# EAGLE design hot-plate_all_v1.0 (EAGLE 6.2)

## Sheet 1 of 4
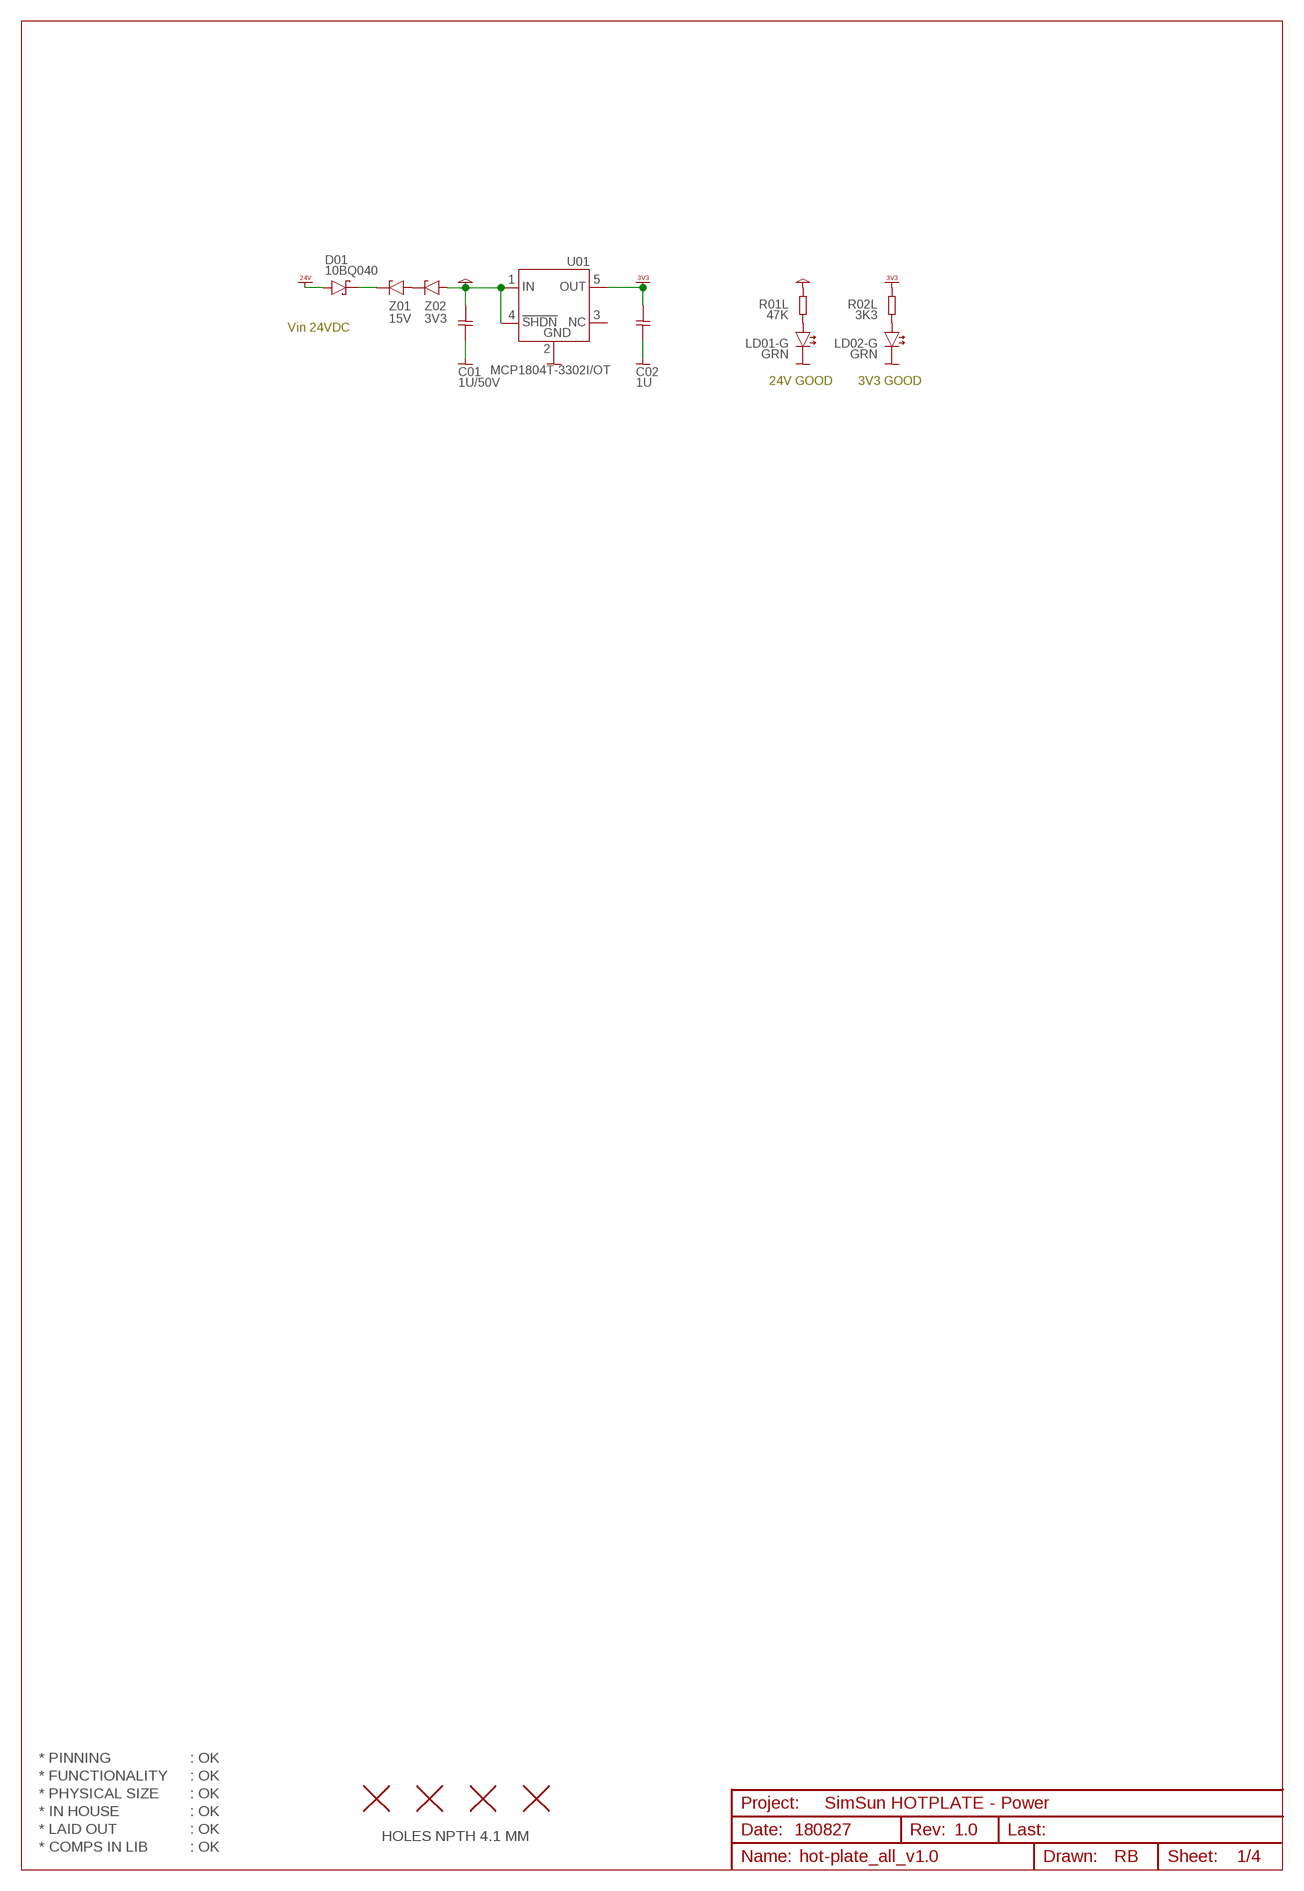
[diagram p0: schematic, sheet 1]

### Parts
C01  1U/50V  CAP0603  [CAP0603]
C02  1U  CAP0603  [CAP0603]
D01  10BQ040  DIODE_15MQ040  [DIODE_SMA]
H1  HOLE_NPTH_4.1MM  [HOLE_NPTH_4.1MM]
H2  HOLE_NPTH_4.1MM  [HOLE_NPTH_4.1MM]
H3  HOLE_NPTH_4.1MM  [HOLE_NPTH_4.1MM]
H4  HOLE_NPTH_4.1MM  [HOLE_NPTH_4.1MM]
LD01-G  GRN  LED_SMD_0603  [LED_SMD_0603]
LD02-G  GRN  LED_SMD_0603  [LED_SMD_0603]
R01L  47K  RES0603  [RES0603]
R02L  3K3  RES0603  [RES0603]
U01  MCP1804T-3302I/OT  [SOT23-5]
Z01  15V  ZENER_SOD80  [ZENER_SOD80]
Z02  3V3  ZENER_SOD80  [ZENER_SOD80]

### Nets
GND: C01.2 C02.2 LD01-G.C LD02-G.C U01.2(2.GND) ; also sheet 2,3,4
N$3: LD02-G.A R02L.2
N$25: LD01-G.A R01L.2
N$151: D01.C(-) Z01.2(-)
N$162: Z01.1(+) Z02.2(-)
VCC: C01.1 R01L.1 U01.1(1.IN) U01.4(4.SHDN) Z02.1(+)
VDD_3V3: C02.1 R02L.1 U01.5(5.OUT) ; supply symbol labelled VCC_3V3 ; also sheet 2,4
VDD_24V: D01.A(+) ; supply symbol labelled VCC_24V ; also sheet 2,3
Unconnected: U01.3(3.NC)

### Notes on the sheet
- Vin 24VDC
- 24V GOOD | 3V3 GOOD
- * PINNING | : OK
- * FUNCTIONALITY | : OK
- * PHYSICAL SIZE | : OK
- SimSun HOTPLATE - Power
- * IN HOUSE | : OK
- * LAID OUT | : OK | 180827 | 1.0
- HOLES NPTH 4.1 MM
- * COMPS IN LIB | : OK

## Sheet 2 of 4
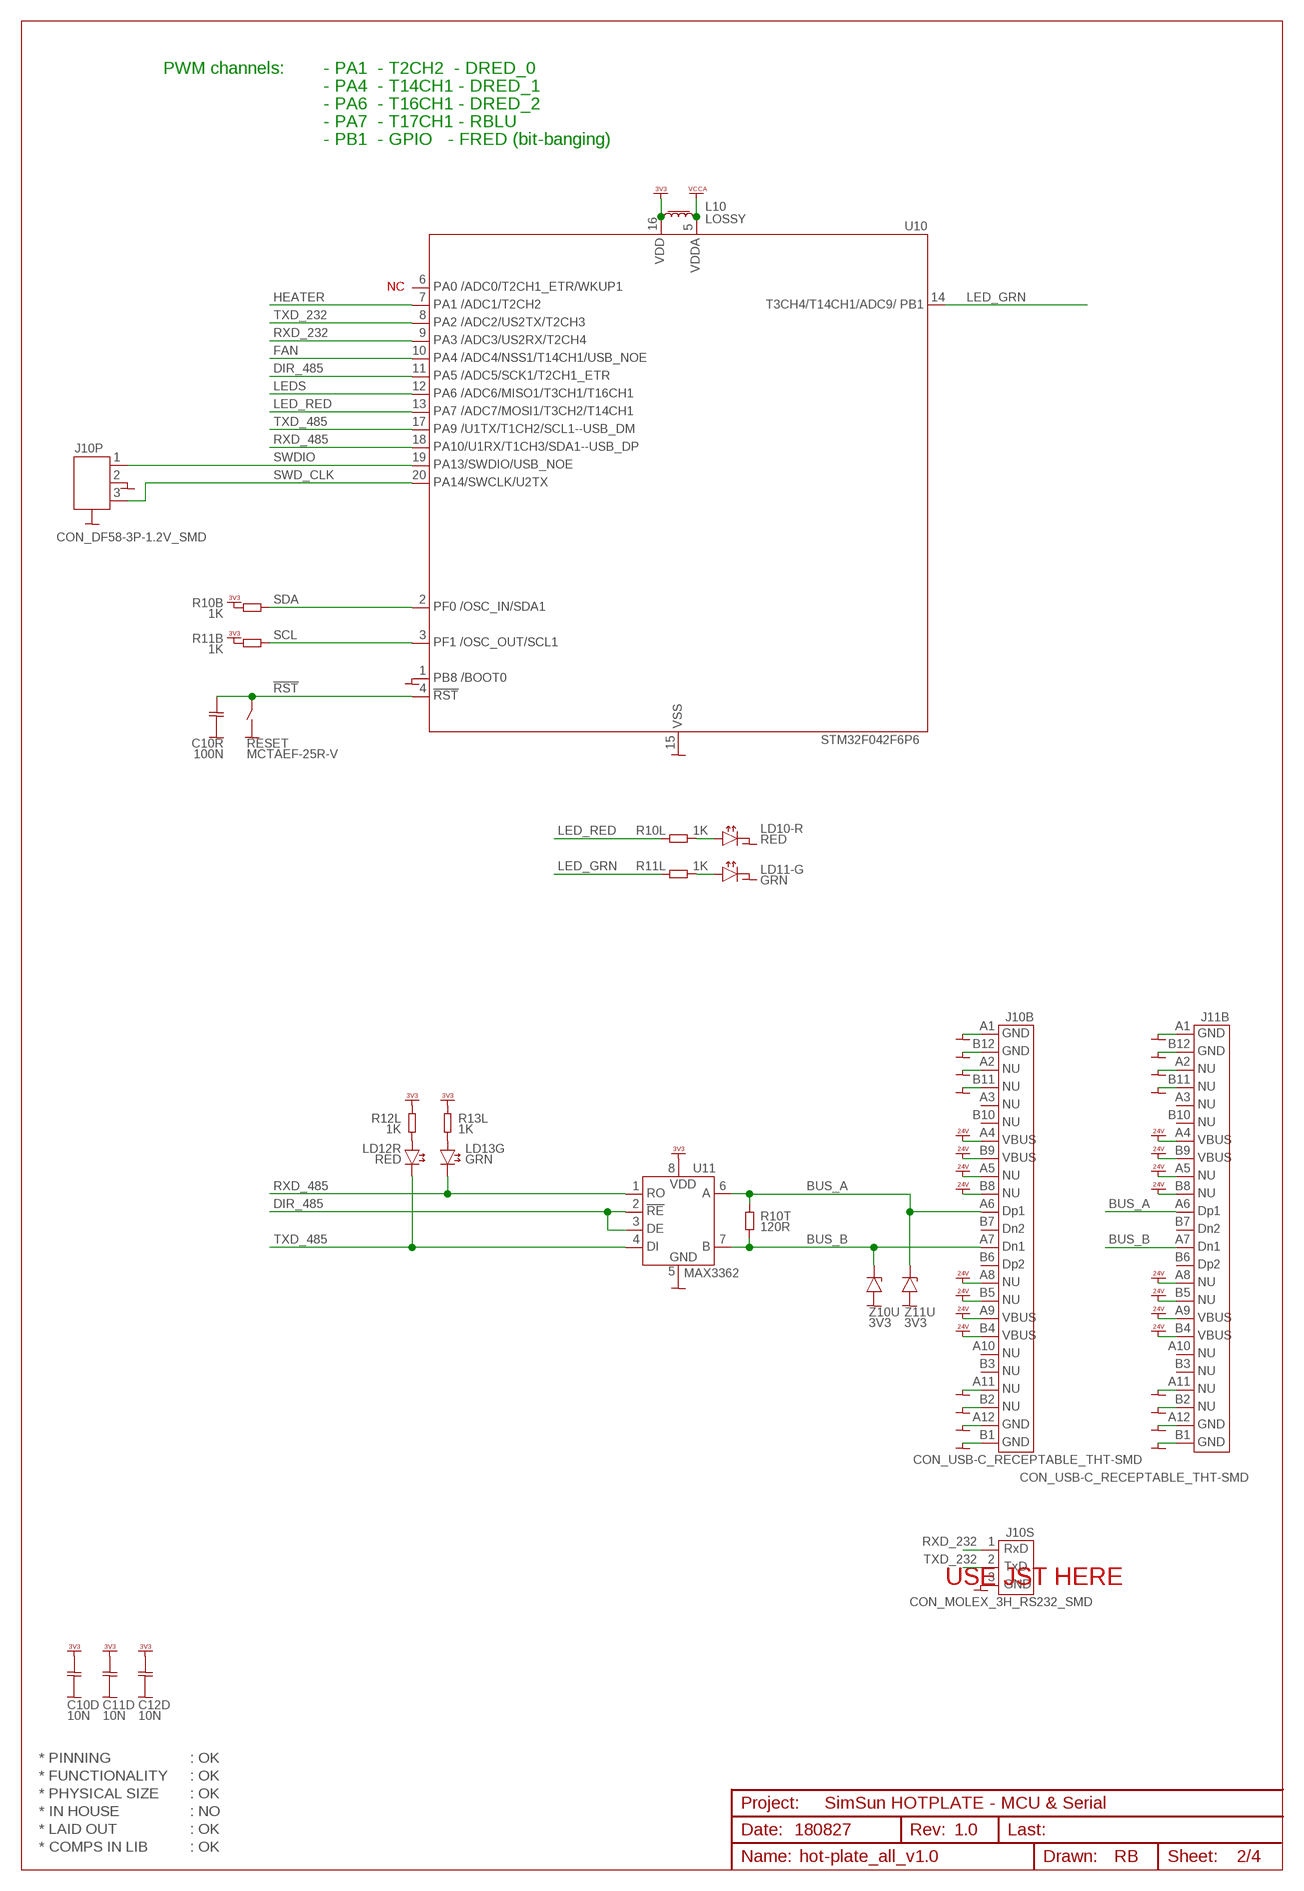
[diagram p1: schematic, sheet 2]

### Parts
C10D  10N  CAP0603  [CAP0603]
C10R  100N  CAP0603  [CAP0603]
C11D  10N  CAP0603  [CAP0603]
C12D  10N  CAP0603  [CAP0603]
J10B  CON_USB-C_RECEPTABLE_THT-SMD  [CON_USB-C_RECEPTABLE_THT-SMD]
J10P  CON_DF58-3P-1.2V_SMD  [CON_DF58-3P-1.2V_SMD]
J10S  CON_MOLEX_3H_RS232_SMD  [CON_MOLEX_3H+SMD]
J11B  CON_USB-C_RECEPTABLE_THT-SMD  [CON_USB-C_RECEPTABLE_THT-SMD]
L10  LOSSY  L_0603  [L_0603]
LD10-R  RED  LED_SMD_0603  [LED_SMD_0603]
LD11-G  GRN  LED_SMD_0603  [LED_SMD_0603]
LD12R  RED  LED_SMD_0603  [LED_SMD_0603]
LD13G  GRN  LED_SMD_0603  [LED_SMD_0603]
R10B  1K  RES0603  [RES0603]
R10L  1K  RES0603  [RES0603]
R10T  120R  RES0603  [RES0603]
R11B  1K  RES0603  [RES0603]
R11L  1K  RES0603  [RES0603]
R12L  1K  RES0603  [RES0603]
R13L  1K  RES0603  [RES0603]
RESET  MCTAEF-25R-V  SWITCH_PUSHBUTTON  [SWITCH_SMD_PBUTTON_2P]
U10  STM32F042F6P6  [TSSOP20]
U11  MAX3362  [SOT23-8]
Z10U  3V3  ZENER_SOD80  [ZENER_SOD80]
Z11U  3V3  ZENER_SOD80  [ZENER_SOD80]

### Nets
!RST: C10R.1 RESET.2(3-4) U10.4(4.!RST)
BUS_A: J10B.A6(A6.DP1) J11B.A6(A6.DP1) R10T.1 U11.6(6.A) Z11U.2(-)
BUS_B: J10B.A7(A7.DN1) J11B.A7(A7.DN1) R10T.2 U11.7(7.B) Z10U.2(-)
DIR_485: U10.11(11.PA5) U11.2(2.!RE) U11.3(3.DE)
FAN: U10.10(10.PA4) ; also sheet 3
GND: C10D.2 C10R.2 C11D.2 C12D.2 J10B.A1(A1.GND) J10B.A2(A2.NU) J10B.A11(A11.NU) J10B.A12(A12.GND) J10B.B1(B1.GND) J10B.B2(B2.NU) J10B.B11(B11.NU) J10B.B12(B12.GND) J10P.2 J10P.GND1 J10P.GND2 J10S.3 J11B.A1(A1.GND) J11B.A2(A2.NU) J11B.A11(A11.NU) J11B.A12(A12.GND) J11B.B1(B1.GND) J11B.B2(B2.NU) J11B.B11(B11.NU) J11B.B12(B12.GND) LD10-R.C LD11-G.C RESET.1(1-2) U10.1(1.BOOT0) U10.15(15.GND) U11.5(5.GND) Z10U.1(+) Z11U.1(+) ; also sheet 1,3,4
HEATER: U10.7(7.PA1) ; also sheet 3
LED_GRN: R11L.1 U10.14(14.PB1)
LED_RED: R10L.1 U10.13(13.PA7)
LEDS: U10.12(12.PA6) ; also sheet 3
N$148: LD11-G.A R11L.2
N$149: LD10-R.A R10L.2
N$152: LD13G.A R13L.2
N$153: LD12R.A R12L.2
RXD_232: J10S.1 U10.9(9.PA3)
RXD_485: LD13G.C U10.18(18.PA10) U11.1(1.RO)
SCL: R11B.2 U10.3(3.OSC_OUT) ; also sheet 4
SDA: R10B.2 U10.2(2.OSC_IN) ; also sheet 4
SWD_CLK: J10P.3 U10.20(20.PA14)
SWDIO: J10P.1 U10.19(19.PA13)
TXD_232: J10S.2 U10.8(8.PA2)
TXD_485: LD12R.C U10.17(17.PA9) U11.4(4.DI)
VCCA: L10.2 U10.5(5.VDDA)
VDD_3V3: C10D.1 C11D.1 C12D.1 L10.1 R10B.1 R11B.1 R12L.1 R13L.1 U10.16(16.VDD) U11.8(8.VDD) ; supply symbol labelled VCC_3V3 ; also sheet 1,4
VDD_24V: J10B.A4(A4.VBUS) J10B.A5(A5.NU) J10B.A8(A8.NU) J10B.A9(A9.VBUS) J10B.B4(B4.VBUS) J10B.B5(B5.NU) J10B.B8(B8.NU) J10B.B9(B9.VBUS) J11B.A4(A4.VBUS) J11B.A5(A5.NU) J11B.A8(A8.NU) J11B.A9(A9.VBUS) J11B.B4(B4.VBUS) J11B.B5(B5.NU) J11B.B8(B8.NU) J11B.B9(B9.VBUS) ; supply symbol labelled VCC_24V ; also sheet 1,3
Unconnected: J10B.A3(A3.NU) J10B.A10(A10.NU) J10B.B3(B3.NU) J10B.B6(B6.DP2) J10B.B7(B7.DN2) J10B.B10(B10.NU) J11B.A3(A3.NU) J11B.A10(A10.NU) J11B.B3(B3.NU) J11B.B6(B6.DP2) J11B.B7(B7.DN2) J11B.B10(B10.NU) U10.6(6.PA0)

### Notes on the sheet
- PWM channels: | - PA1  - T2CH2  - DRED_0
- - PA4  - T14CH1 - DRED_1
- - PA6  - T16CH1 - DRED_2
- - PA7  - T17CH1 - RBLU
- - PB1  - GPIO   - FRED (bit-banging)
- NC
- USE JST HERE
- * PINNING | : OK
- * FUNCTIONALITY | : OK
- * PHYSICAL SIZE | : OK
- SimSun HOTPLATE - MCU & Serial
- * IN HOUSE | : NO
- * LAID OUT | : OK | 180827 | 1.0
- * COMPS IN LIB | : OK

## Sheet 3 of 4
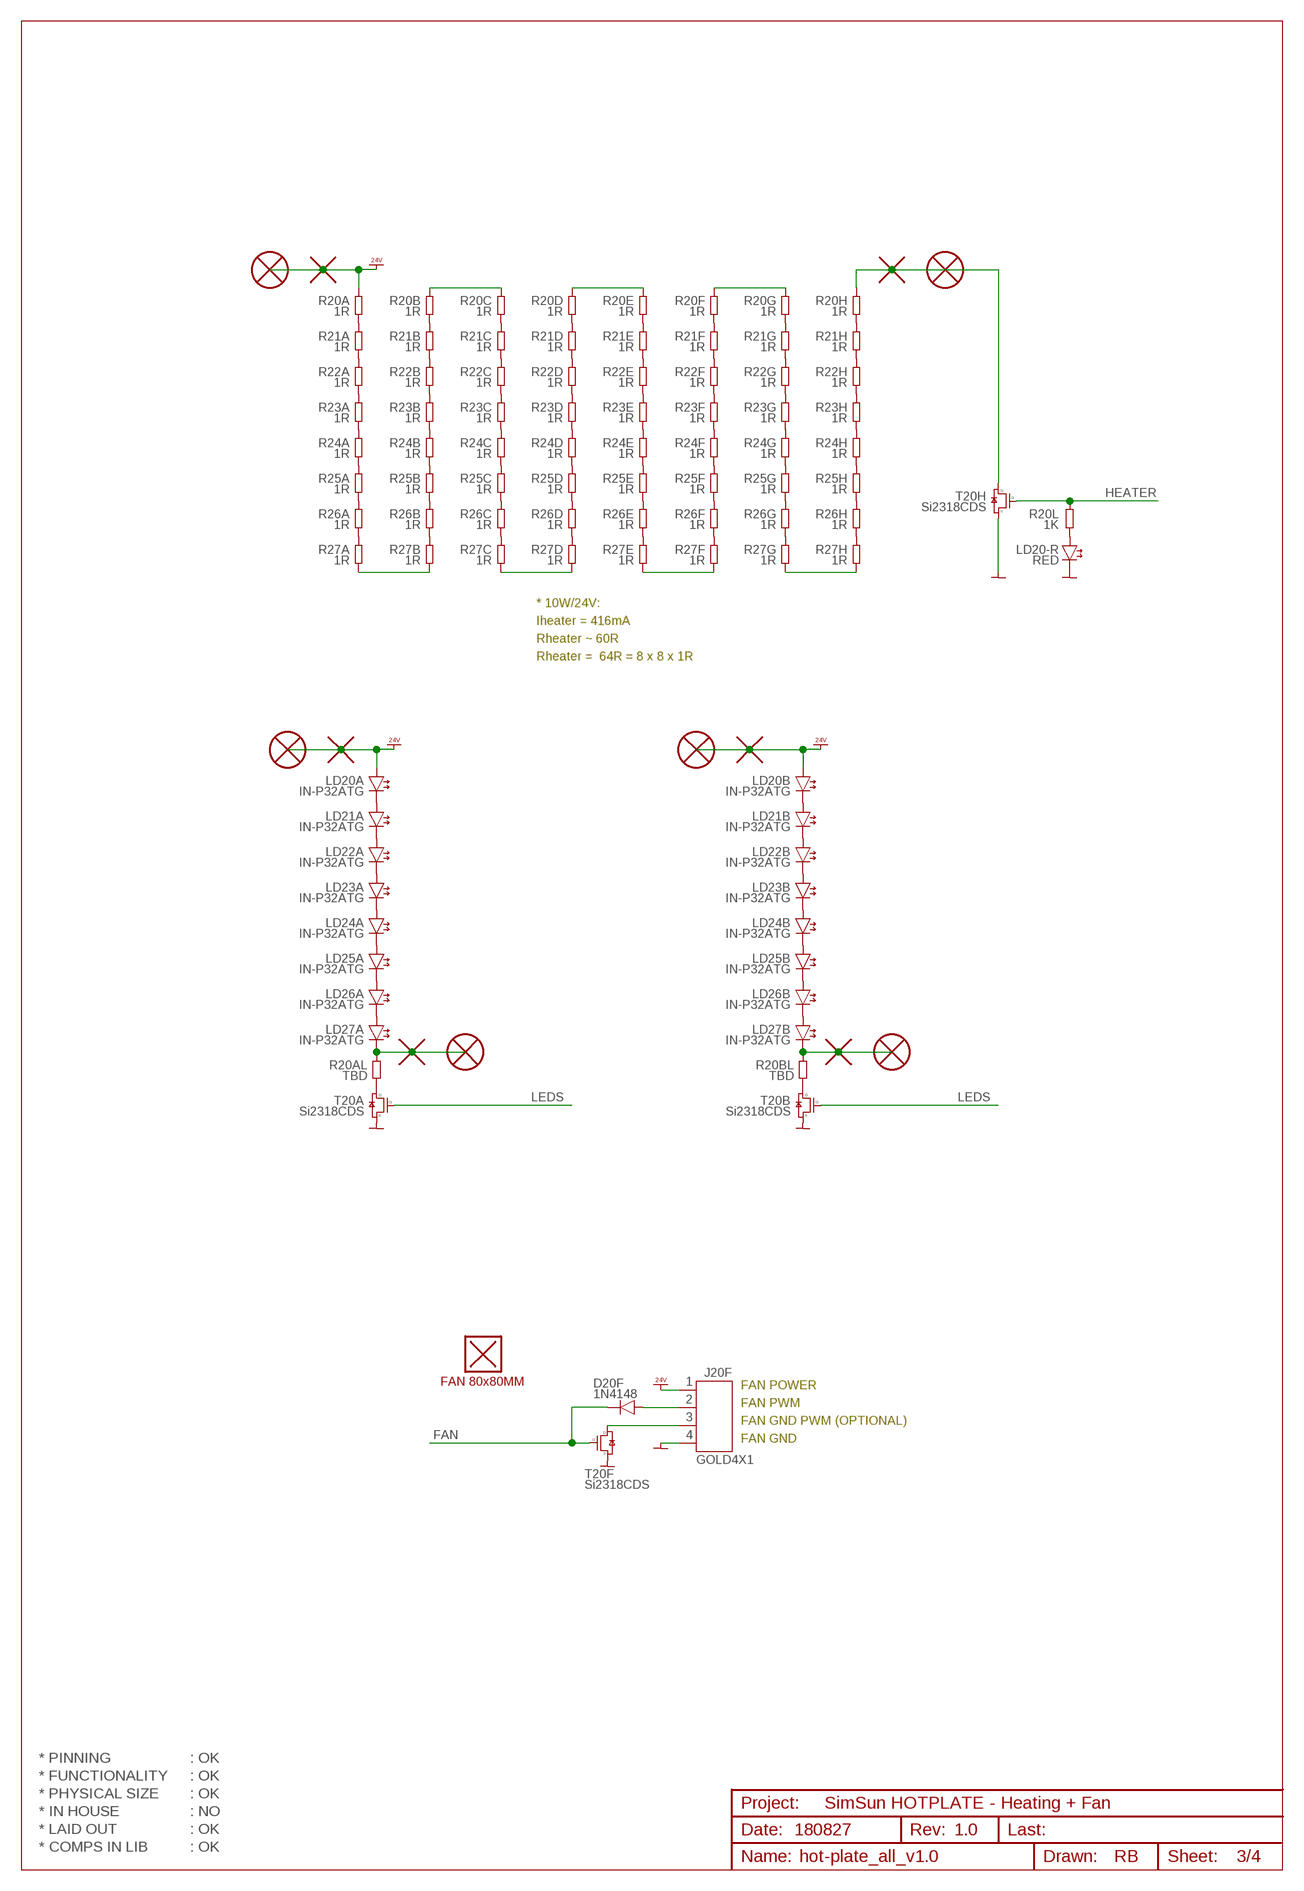
[diagram p2: schematic, sheet 3]

### Parts
D20F  1N4148  DIODE_1N4148WS  [DIODE_SOD323]
H5  HOLE_PTH_1.0MM  [HOLE_PTH_1.0MM]
H6  HOLE_PTH_1.0MM  [HOLE_PTH_1.0MM]
H9  FAN_80X80MM_SANYO_SANACE80  [FAN_80X80MM_SANYO_SANACE80]
H10  HOLE_PTH_1.0MM  [HOLE_PTH_1.0MM]
H15  HOLE_PTH_1.0MM  [HOLE_PTH_1.0MM]
H16  HOLE_PTH_1.0MM  [HOLE_PTH_1.0MM]
H17  HOLE_PTH_1.0MM  [HOLE_PTH_1.0MM]
H18  PAD_ROUND_3.2MM  [PAD_ROUND_3.2MM]
H19  PAD_ROUND_3.2MM  [PAD_ROUND_3.2MM]
H20  PAD_ROUND_3.2MM  [PAD_ROUND_3.2MM]
H21  PAD_ROUND_3.2MM  [PAD_ROUND_3.2MM]
H22  PAD_ROUND_3.2MM  [PAD_ROUND_3.2MM]
H23  PAD_ROUND_3.2MM  [PAD_ROUND_3.2MM]
J20F  GOLD4X1  [GOLD4X1]
LD20-R  RED  LED_SMD_0603  [LED_SMD_0603]
LD20A  IN-P32ATG  LED_SMD_PLCC2  [LED_SMD_PLCC2]
LD20B  IN-P32ATG  LED_SMD_PLCC2  [LED_SMD_PLCC2]
LD21A  IN-P32ATG  LED_SMD_PLCC2  [LED_SMD_PLCC2]
LD21B  IN-P32ATG  LED_SMD_PLCC2  [LED_SMD_PLCC2]
LD22A  IN-P32ATG  LED_SMD_PLCC2  [LED_SMD_PLCC2]
LD22B  IN-P32ATG  LED_SMD_PLCC2  [LED_SMD_PLCC2]
LD23A  IN-P32ATG  LED_SMD_PLCC2  [LED_SMD_PLCC2]
LD23B  IN-P32ATG  LED_SMD_PLCC2  [LED_SMD_PLCC2]
LD24A  IN-P32ATG  LED_SMD_PLCC2  [LED_SMD_PLCC2]
LD24B  IN-P32ATG  LED_SMD_PLCC2  [LED_SMD_PLCC2]
LD25A  IN-P32ATG  LED_SMD_PLCC2  [LED_SMD_PLCC2]
LD25B  IN-P32ATG  LED_SMD_PLCC2  [LED_SMD_PLCC2]
LD26A  IN-P32ATG  LED_SMD_PLCC2  [LED_SMD_PLCC2]
LD26B  IN-P32ATG  LED_SMD_PLCC2  [LED_SMD_PLCC2]
LD27A  IN-P32ATG  LED_SMD_PLCC2  [LED_SMD_PLCC2]
LD27B  IN-P32ATG  LED_SMD_PLCC2  [LED_SMD_PLCC2]
R20A  1R  RES2512  [RES2512]
R20AL  TBD  RES0603  [RES0603]
R20B  1R  RES2512  [RES2512]
R20BL  TBD  RES0603  [RES0603]
R20C  1R  RES2512  [RES2512]
R20D  1R  RES2512  [RES2512]
R20E  1R  RES2512  [RES2512]
R20F  1R  RES2512  [RES2512]
R20G  1R  RES2512  [RES2512]
R20H  1R  RES2512  [RES2512]
R20L  1K  RES0603  [RES0603]
R21A  1R  RES2512  [RES2512]
R21B  1R  RES2512  [RES2512]
R21C  1R  RES2512  [RES2512]
R21D  1R  RES2512  [RES2512]
R21E  1R  RES2512  [RES2512]
R21F  1R  RES2512  [RES2512]
R21G  1R  RES2512  [RES2512]
R21H  1R  RES2512  [RES2512]
R22A  1R  RES2512  [RES2512]
R22B  1R  RES2512  [RES2512]
R22C  1R  RES2512  [RES2512]
R22D  1R  RES2512  [RES2512]
R22E  1R  RES2512  [RES2512]
R22F  1R  RES2512  [RES2512]
R22G  1R  RES2512  [RES2512]
R22H  1R  RES2512  [RES2512]
R23A  1R  RES2512  [RES2512]
R23B  1R  RES2512  [RES2512]
R23C  1R  RES2512  [RES2512]
R23D  1R  RES2512  [RES2512]
R23E  1R  RES2512  [RES2512]
R23F  1R  RES2512  [RES2512]
R23G  1R  RES2512  [RES2512]
R23H  1R  RES2512  [RES2512]
R24A  1R  RES2512  [RES2512]
R24B  1R  RES2512  [RES2512]
R24C  1R  RES2512  [RES2512]
R24D  1R  RES2512  [RES2512]
R24E  1R  RES2512  [RES2512]
R24F  1R  RES2512  [RES2512]
R24G  1R  RES2512  [RES2512]
R24H  1R  RES2512  [RES2512]
R25A  1R  RES2512  [RES2512]
R25B  1R  RES2512  [RES2512]
R25C  1R  RES2512  [RES2512]
R25D  1R  RES2512  [RES2512]
R25E  1R  RES2512  [RES2512]
R25F  1R  RES2512  [RES2512]
R25G  1R  RES2512  [RES2512]
R25H  1R  RES2512  [RES2512]
R26A  1R  RES2512  [RES2512]
R26B  1R  RES2512  [RES2512]
R26C  1R  RES2512  [RES2512]
R26D  1R  RES2512  [RES2512]
R26E  1R  RES2512  [RES2512]
R26F  1R  RES2512  [RES2512]
R26G  1R  RES2512  [RES2512]
R26H  1R  RES2512  [RES2512]
R27A  1R  RES2512  [RES2512]
R27B  1R  RES2512  [RES2512]
R27C  1R  RES2512  [RES2512]
R27D  1R  RES2512  [RES2512]
R27E  1R  RES2512  [RES2512]
R27F  1R  RES2512  [RES2512]
R27G  1R  RES2512  [RES2512]
R27H  1R  RES2512  [RES2512]
T20A  Si2318CDS  NFET_SOT23  [NFET_SOT23]
T20B  Si2318CDS  NFET_SOT23  [NFET_SOT23]
T20F  Si2318CDS  NFET_SOT23  [NFET_SOT23]
T20H  Si2318CDS  NFET_SOT23  [NFET_SOT23]

### Nets
FAN: D20F.1-(-) T20F.1(G1) ; also sheet 2
GND: J20F.4 LD20-R.C T20A.2(S2) T20B.2(S2) T20F.2(S2) T20H.2(S2) ; also sheet 1,2,4
HEATER: R20L.1 T20H.1(G1) ; also sheet 2
LEDS: T20A.1(G1) T20B.1(G1) ; also sheet 2
N$4: R20A.2 R21A.1
N$5: R21A.2 R22A.1
N$6: R22A.2 R23A.1
N$7: R23A.2 R24A.1
N$8: R24A.2 R25A.1
N$9: R25A.2 R26A.1
N$10: R26A.2 R27A.1
N$11: R20B.2 R21B.1
N$12: R21B.2 R22B.1
N$14: R22B.2 R23B.1
N$15: R23B.2 R24B.1
N$16: R24B.2 R25B.1
N$17: R25B.2 R26B.1
N$18: R26B.2 R27B.1
N$19: R27A.2 R27B.2
N$20: R20C.2 R21C.1
N$21: R21C.2 R22C.1
N$22: R22C.2 R23C.1
N$23: R23C.2 R24C.1
N$24: R24C.2 R25C.1
N$26: R25C.2 R26C.1
N$27: R26C.2 R27C.1
N$28: R20B.1 R20C.1
N$29: R20D.2 R21D.1
N$30: R21D.2 R22D.1
N$31: R22D.2 R23D.1
N$32: R23D.2 R24D.1
N$33: R24D.2 R25D.1
N$34: R25D.2 R26D.1
N$35: R26D.2 R27D.1
N$36: R27C.2 R27D.2
N$37: R20E.2 R21E.1
N$38: R21E.2 R22E.1
N$39: R22E.2 R23E.1
N$40: R23E.2 R24E.1
N$41: R24E.2 R25E.1
N$42: R25E.2 R26E.1
N$43: R26E.2 R27E.1
N$44: R20D.1 R20E.1
N$45: R20F.2 R21F.1
N$46: R21F.2 R22F.1
N$47: R22F.2 R23F.1
N$48: R23F.2 R24F.1
N$49: R24F.2 R25F.1
N$50: R25F.2 R26F.1
N$51: R26F.2 R27F.1
N$52: R27E.2 R27F.2
N$53: R20G.2 R21G.1
N$54: R21G.2 R22G.1
N$55: R22G.2 R23G.1
N$56: R23G.2 R24G.1
N$57: R24G.2 R25G.1
N$58: R25G.2 R26G.1
N$59: R26G.2 R27G.1
N$60: R20F.1 R20G.1
N$61: R20H.2 R21H.1
N$62: R21H.2 R22H.1
N$63: R22H.2 R23H.1
N$64: R23H.2 R24H.1
N$65: R24H.2 R25H.1
N$66: R25H.2 R26H.1
N$67: R26H.2 R27H.1
N$68: R27G.2 R27H.2
N$69: H5.1 H19.P R20H.1 T20H.3(D3)
N$70: LD20-R.A R20L.2
N$71: LD20A.C(-) LD21A.A(+)
N$72: LD21A.C(-) LD22A.A(+)
N$73: LD22A.C(-) LD23A.A(+)
N$74: LD23A.C(-) LD24A.A(+)
N$75: LD24A.C(-) LD25A.A(+)
N$76: LD25A.C(-) LD26A.A(+)
N$77: LD20B.C(-) LD21B.A(+)
N$78: LD21B.C(-) LD22B.A(+)
N$79: LD22B.C(-) LD23B.A(+)
N$80: LD23B.C(-) LD24B.A(+)
N$81: LD24B.C(-) LD25B.A(+)
N$82: LD25B.C(-) LD26B.A(+)
N$83: LD26A.C(-) LD27A.A(+)
N$84: LD26B.C(-) LD27B.A(+)
N$85: H16.1 H23.P LD27B.C(-) R20BL.1
N$86: H17.1 H22.P LD27A.C(-) R20AL.1
N$87: R20AL.2 T20A.3(D3)
N$88: R20BL.2 T20B.3(D3)
N$89: J20F.3 T20F.3(D3)
N$90: D20F.2(+) J20F.2
VDD_24V: H6.1 H10.1 H15.1 H18.P H20.P H21.P J20F.1 LD20A.A(+) LD20B.A(+) R20A.1 ; supply symbol labelled VCC_24V ; also sheet 1,2

### Notes on the sheet
- * 10W/24V:
- Iheater = 416mA
- Rheater ~ 60R
- Rheater =  64R = 8 x 8 x 1R
- FAN POWER
- FAN PWM
- FAN GND PWM (OPTIONAL)
- FAN GND
- * PINNING | : OK
- * FUNCTIONALITY | : OK
- * PHYSICAL SIZE | : OK
- SimSun HOTPLATE - Heating + Fan
- * IN HOUSE | : NO
- * LAID OUT | : OK | 180827 | 1.0
- * COMPS IN LIB | : OK

## Sheet 4 of 4
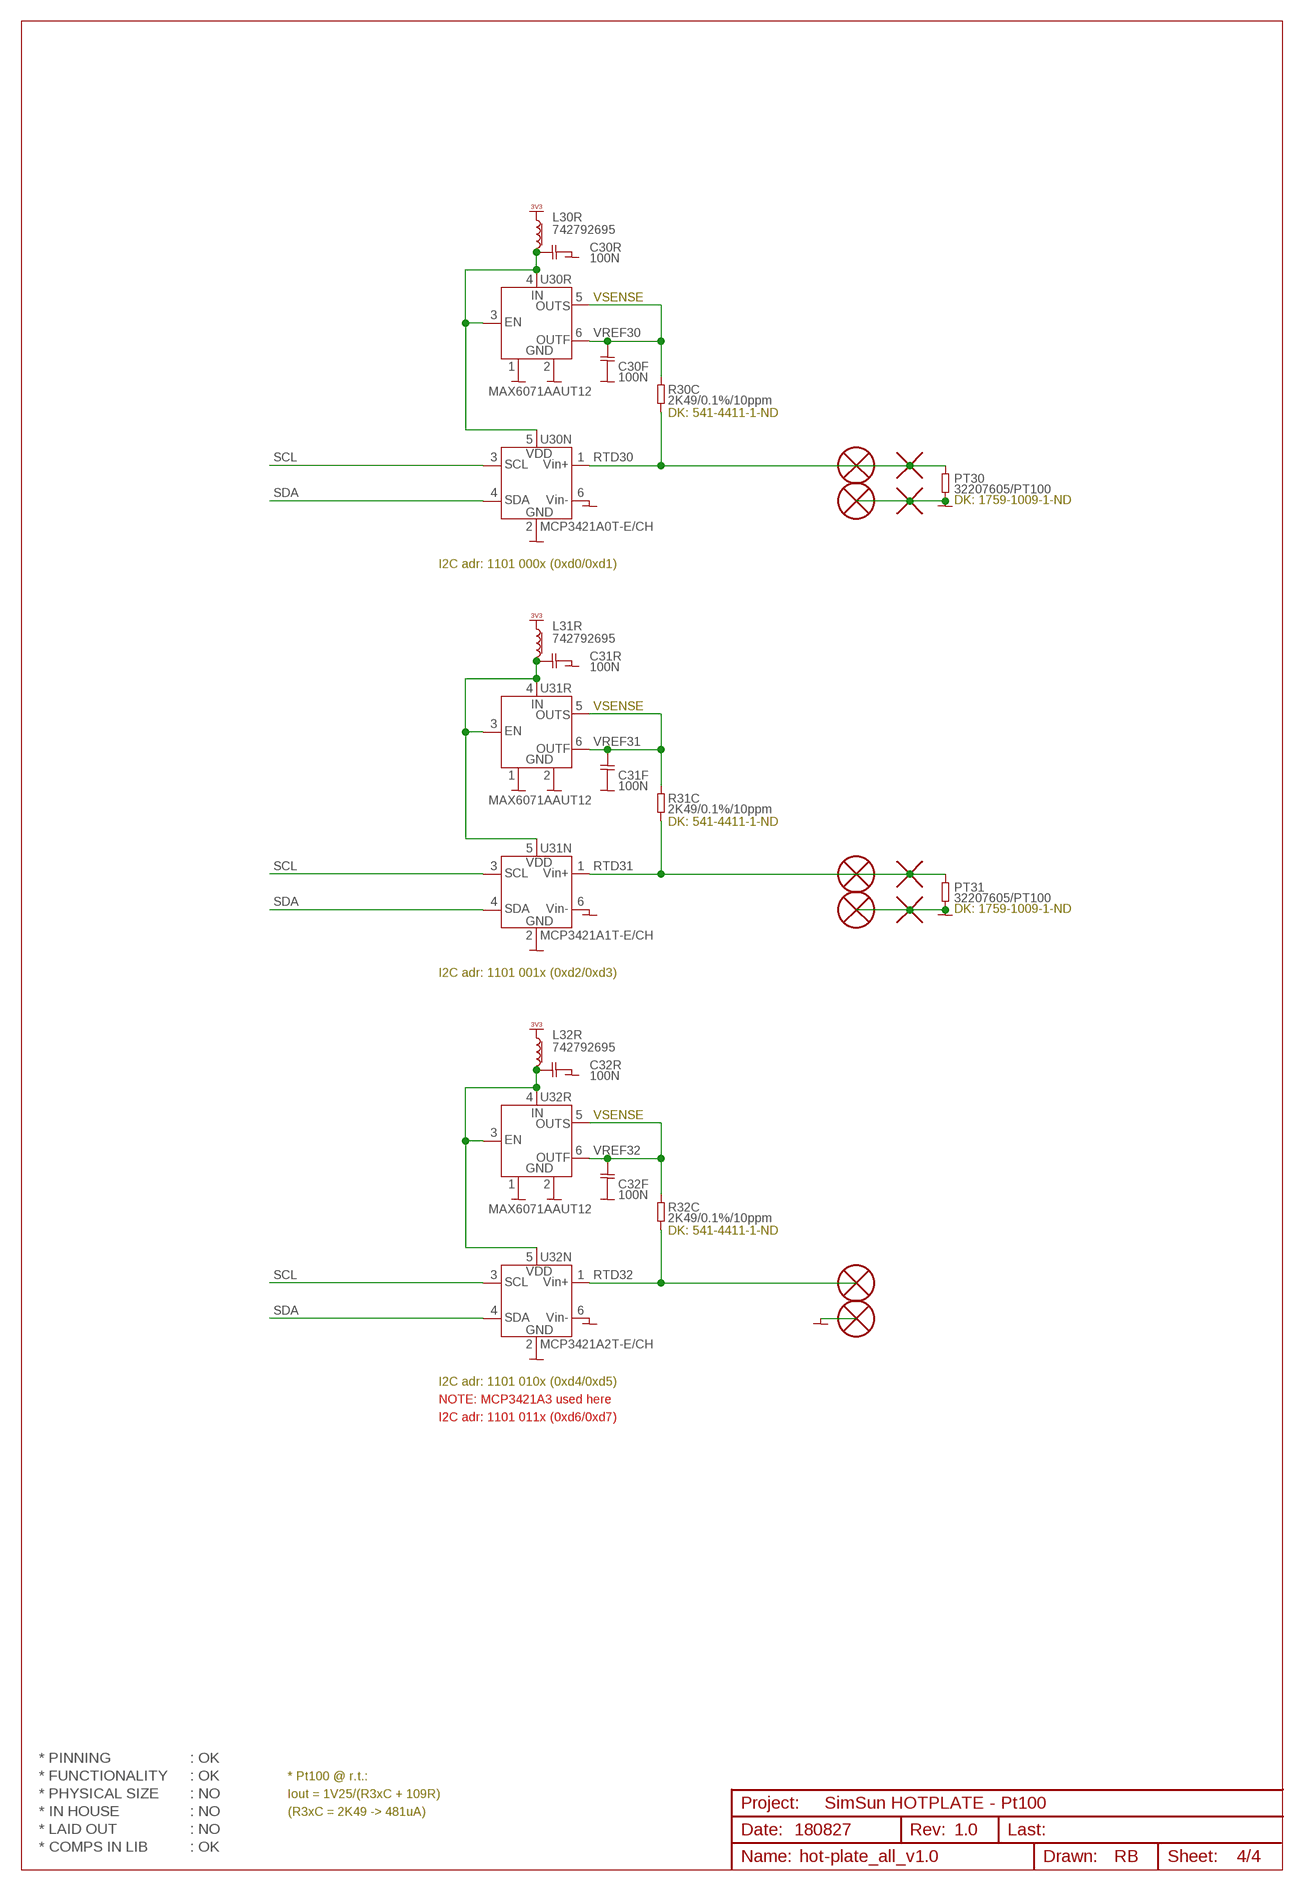
[diagram p3: schematic, sheet 4]

### Parts
C30F  100N  CAP0603  [CAP0603]
C30R  100N  CAP0603  [CAP0603]
C31F  100N  CAP0603  [CAP0603]
C31R  100N  CAP0603  [CAP0603]
C32F  100N  CAP0603  [CAP0603]
C32R  100N  CAP0603  [CAP0603]
H7  HOLE_PTH_1.0MM  [HOLE_PTH_1.0MM]
H8  HOLE_PTH_1.0MM  [HOLE_PTH_1.0MM]
H11  HOLE_PTH_1.0MM  [HOLE_PTH_1.0MM]
H12  HOLE_PTH_1.0MM  [HOLE_PTH_1.0MM]
H13  HOLE_PTH_1.0MM  [HOLE_PTH_1.0MM]
H14  HOLE_PTH_1.0MM  [HOLE_PTH_1.0MM]
H24  PAD_ROUND_3.2MM  [PAD_ROUND_3.2MM]
H25  PAD_ROUND_3.2MM  [PAD_ROUND_3.2MM]
H26  PAD_ROUND_3.2MM  [PAD_ROUND_3.2MM]
H27  PAD_ROUND_3.2MM  [PAD_ROUND_3.2MM]
L30R  742792695  L_0603  [L_0603]
L31R  742792695  L_0603  [L_0603]
L32R  742792695  L_0603  [L_0603]
PT30  32207605/PT100  RES0805  [RES0805]
PT31  32207605/PT100  RES0805  [RES0805]
R30C  2K49/0.1%/10ppm  RES0603  [RES0603]
R31C  2K49/0.1%/10ppm  RES0603  [RES0603]
R32C  2K49/0.1%/10ppm  RES0603  [RES0603]
U30N  MCP3421A0T-E/CH  [SOT23-6]
U30R  MAX6071AAUT12  [SOT23-6]
U31N  MCP3421A1T-E/CH  [SOT23-6]
U31R  MAX6071AAUT12  [SOT23-6]
U32N  MCP3421A2T-E/CH  [SOT23-6]
U32R  MAX6071AAUT12  [SOT23-6]

### Nets
GND: C30F.1 C30R.1 C31F.1 C31R.1 C32F.1 C32R.1 H8.1 H12.1 H14.1 H25.P H27.P PT30.2 PT31.2 U30N.2(2.VSS) U30N.6(6.VIN-) U30R.1(1.GND) U30R.2(2.GND) U31N.2(2.VSS) U31N.6(6.VIN-) U31R.1(1.GND) U31R.2(2.GND) U32N.2(2.VSS) U32N.6(6.VIN-) U32R.1(1.GND) U32R.2(2.GND) ; also sheet 1,2,3
N$1: C31R.2 L31R.2 U31N.5(5.VDD) U31R.3(3.EN) U31R.4(4.IN)
N$2: C32R.2 L32R.2 U32N.5(5.VDD) U32R.3(3.EN) U32R.4(4.IN)
N$13: C30R.2 L30R.2 U30N.5(5.VDD) U30R.3(3.EN) U30R.4(4.IN)
RTD30: H7.1 H24.P PT30.1 R30C.2 U30N.1(1.VIN+)
RTD31: H11.1 H26.P PT31.1 R31C.2 U31N.1(1.VIN+)
RTD32: H13.1 R32C.2 U32N.1(1.VIN+)
SCL: U30N.3(3.SCL) U31N.3(3.SCL) U32N.3(3.SCL) ; also sheet 2
SDA: U30N.4(4.SDA) U31N.4(4.SDA) U32N.4(4.SDA) ; also sheet 2
VDD_3V3: L30R.1 L31R.1 L32R.1 ; supply symbol labelled VCC_3V3 ; also sheet 1,2
VREF30: C30F.2 R30C.1 U30R.5(5.OUTS) U30R.6(6.OUTF)
VREF31: C31F.2 R31C.1 U31R.5(5.OUTS) U31R.6(6.OUTF)
VREF32: C32F.2 R32C.1 U32R.5(5.OUTS) U32R.6(6.OUTF)

### Notes on the sheet
- VSENSE
- DK: 541-4411-1-ND
- DK: 1759-1009-1-ND
- I2C adr: 1101 000x (0xd0/0xd1)
- VSENSE
- DK: 541-4411-1-ND
- DK: 1759-1009-1-ND
- I2C adr: 1101 001x (0xd2/0xd3)
- VSENSE
- DK: 541-4411-1-ND
- I2C adr: 1101 010x (0xd4/0xd5)
- NOTE: MCP3421A3 used here
- I2C adr: 1101 011x (0xd6/0xd7)
- * PINNING | : OK
- * FUNCTIONALITY | : OK | * Pt100 @ r.t.:
- * PHYSICAL SIZE | : NO | Iout = 1V25/(R3xC + 109R)
- SimSun HOTPLATE - Pt100
- * IN HOUSE | : NO | (R3xC = 2K49 -> 481uA)
- * LAID OUT | : NO | 180827 | 1.0
- * COMPS IN LIB | : OK

## Library data of the parts
C01 C02 C10D C10R C11D C12D C30F C30R C31F C31R C32F C32R = 00-own_parts:CAP0603: Capacitor, ceramic, 0603
D01 = 00-own_parts:DIODE_15MQ040: Diode, Schottky, 15MQ040, 40V/3A, SMA, F# 165-1114
D20F = 00-own_parts:DIODE_1N4148WS: Diode, 1N4148WS, high speed, 100V/350mA, SOD323
H1-H4 = 00-own_parts:HOLE_NPTH_4.1MM: Hole, NPTH, 4.1mm
H5-H8 H10-H17 = 00-own_parts:HOLE_PTH_1.0MM: Hole, PTH, 1.0mm
H9 = 00-own_parts:FAN_80X80MM_SANYO_SANACE80: Fan, 80x80MM, Sanyo 9GA0824P7G001, with PWM control function & pulse sensor, DK# 1688-1603-ND
H18-H27 = 00-own_parts:PAD_ROUND_3.2MM: Pad, SMD, round 3.2mm
J10B J11B = 00-own_parts:CON_USB-C_RECEPTABLE_THT-SMD: Connector, DB25, male, straight, wirewarp, press nuts, DK#: 2625FA-ND
J10P = 00-own_parts:CON_DF58-3P-1.2V_SMD: Connector, DF58, 3 way, 1,2mm pitch, SMD
J10S = 00-own_parts:CON_MOLEX_3H_RS232_SMD: Connector, RS232, 3p, SMD pads
J20F = 00-own_parts:GOLD4X1: Header, gold fingers, 0.1", 4x1
L10 L30R L31R L32R = 00-own_parts:L_0603: Inductor, 0603, chip ferrite bead
LD01-G LD02-G LD10-R LD11-G LD12R LD13G LD20-R = 00-own_parts:LED_SMD_0603: LED, SMD, 0603
LD20A LD20B LD21A LD21B LD22A LD22B LD23A LD23B LD24A LD24B LD25A LD25B LD26A LD26B LD27A LD27B = 00-own_parts:LED_SMD_PLCC2: LED, SMD, PLCC2
PT30 PT31 R01L R02L R10B R10L R10T R11B R11L R12L R13L R20A R20AL R20B R20BL R20C R20D R20E R20F R20G R20H R20L R21A R21B R21C R21D R21E R21F R21G R21H R22A R22B R22C R22D R22E R22F R22G R22H R23A R23B R23C R23D R23E R23F R23G R23H R24A R24B R24C R24D R24E R24F R24G R24H R25A R25B R25C R25D R25E R25F R25G R25H R26A R26B R26C R26D R26E R26F R26G R26H R27A R27B R27C R27D R27E R27F R27G R27H R30C R31C R32C = 00-own_parts:RES
RESET = 00-own_parts:SWITCH_PUSHBUTTON: Switch, push button, SPNO, MCTAEF, F# 160-5485
T20A T20B T20F T20H = 00-own_parts:NFET_SOT23: n-FET, generic SOT23
U01 = 00-own_parts:MCP1804T-3302I/OT: Regulator, LDO w. enable, Vin=2.0..28V, Vout=3V3, Vdrop = 260mV, SOT23-5,
U10 = 00-own_parts:STM32F042F6P6: MCU, low power, ARM Cortex M0, 32-bit, 48 MHz, 32 kB Flash, 6 kB SRAM, 8 kB EEPROM, RTC, xtal-less USB, ADC, cap. touch sensing, TSSOP20
U11 = 00-own_parts:MAX3362: Transceiver, RS485/422, 3V3, SOT23-8
U30N = 00-own_parts:MCP3421A0T-E/CH: ADC, 18-bit sigma-delta, diff. input, w. PGA, internal reference, I2C address 0, SOT23-6, F#160-5567
U30R U31R U32R = 00-own_parts:MAX6071AAUT12: Reference, with enable, 1V25, low noise, 0.04% tol., 6ppm.oC, 10mA SOT23-6
U31N = 00-own_parts:MCP3421A1T-E/CH: ADC, 18-bit sigma-delta, diff. input, w. PGA, internal reference, I2C address 1, SOT23-6
U32N = 00-own_parts:MCP3421A2T-E/CH: ADC, 18-bit sigma-delta, diff. input, w. PGA, internal reference, I2C address 2, SOT23-6
Z01 Z02 Z10U Z11U = 00-own_parts:ZENER_SOD80: Zener, generic SOD80

## Board
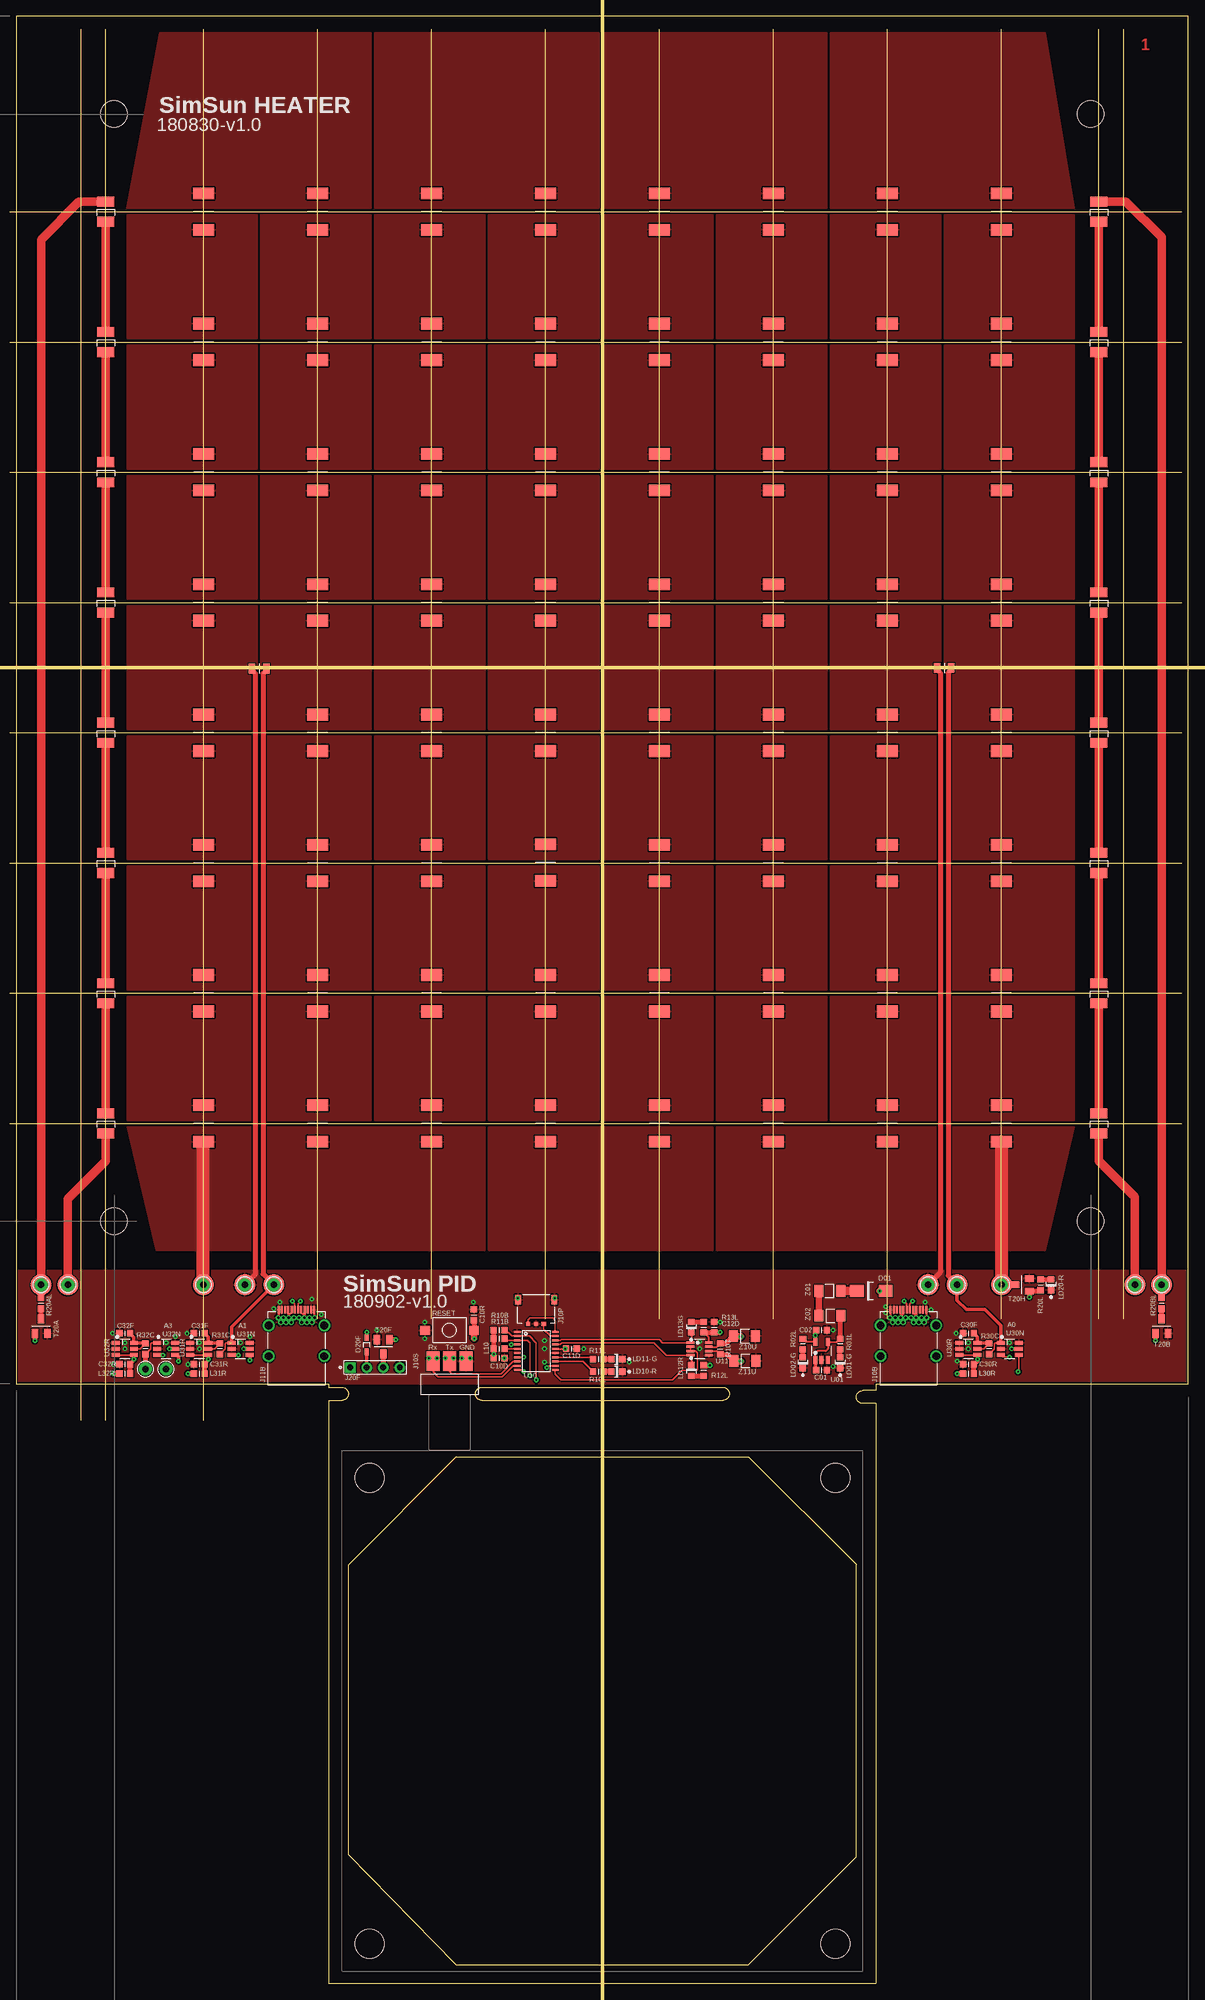
[diagram p4: board, top side]
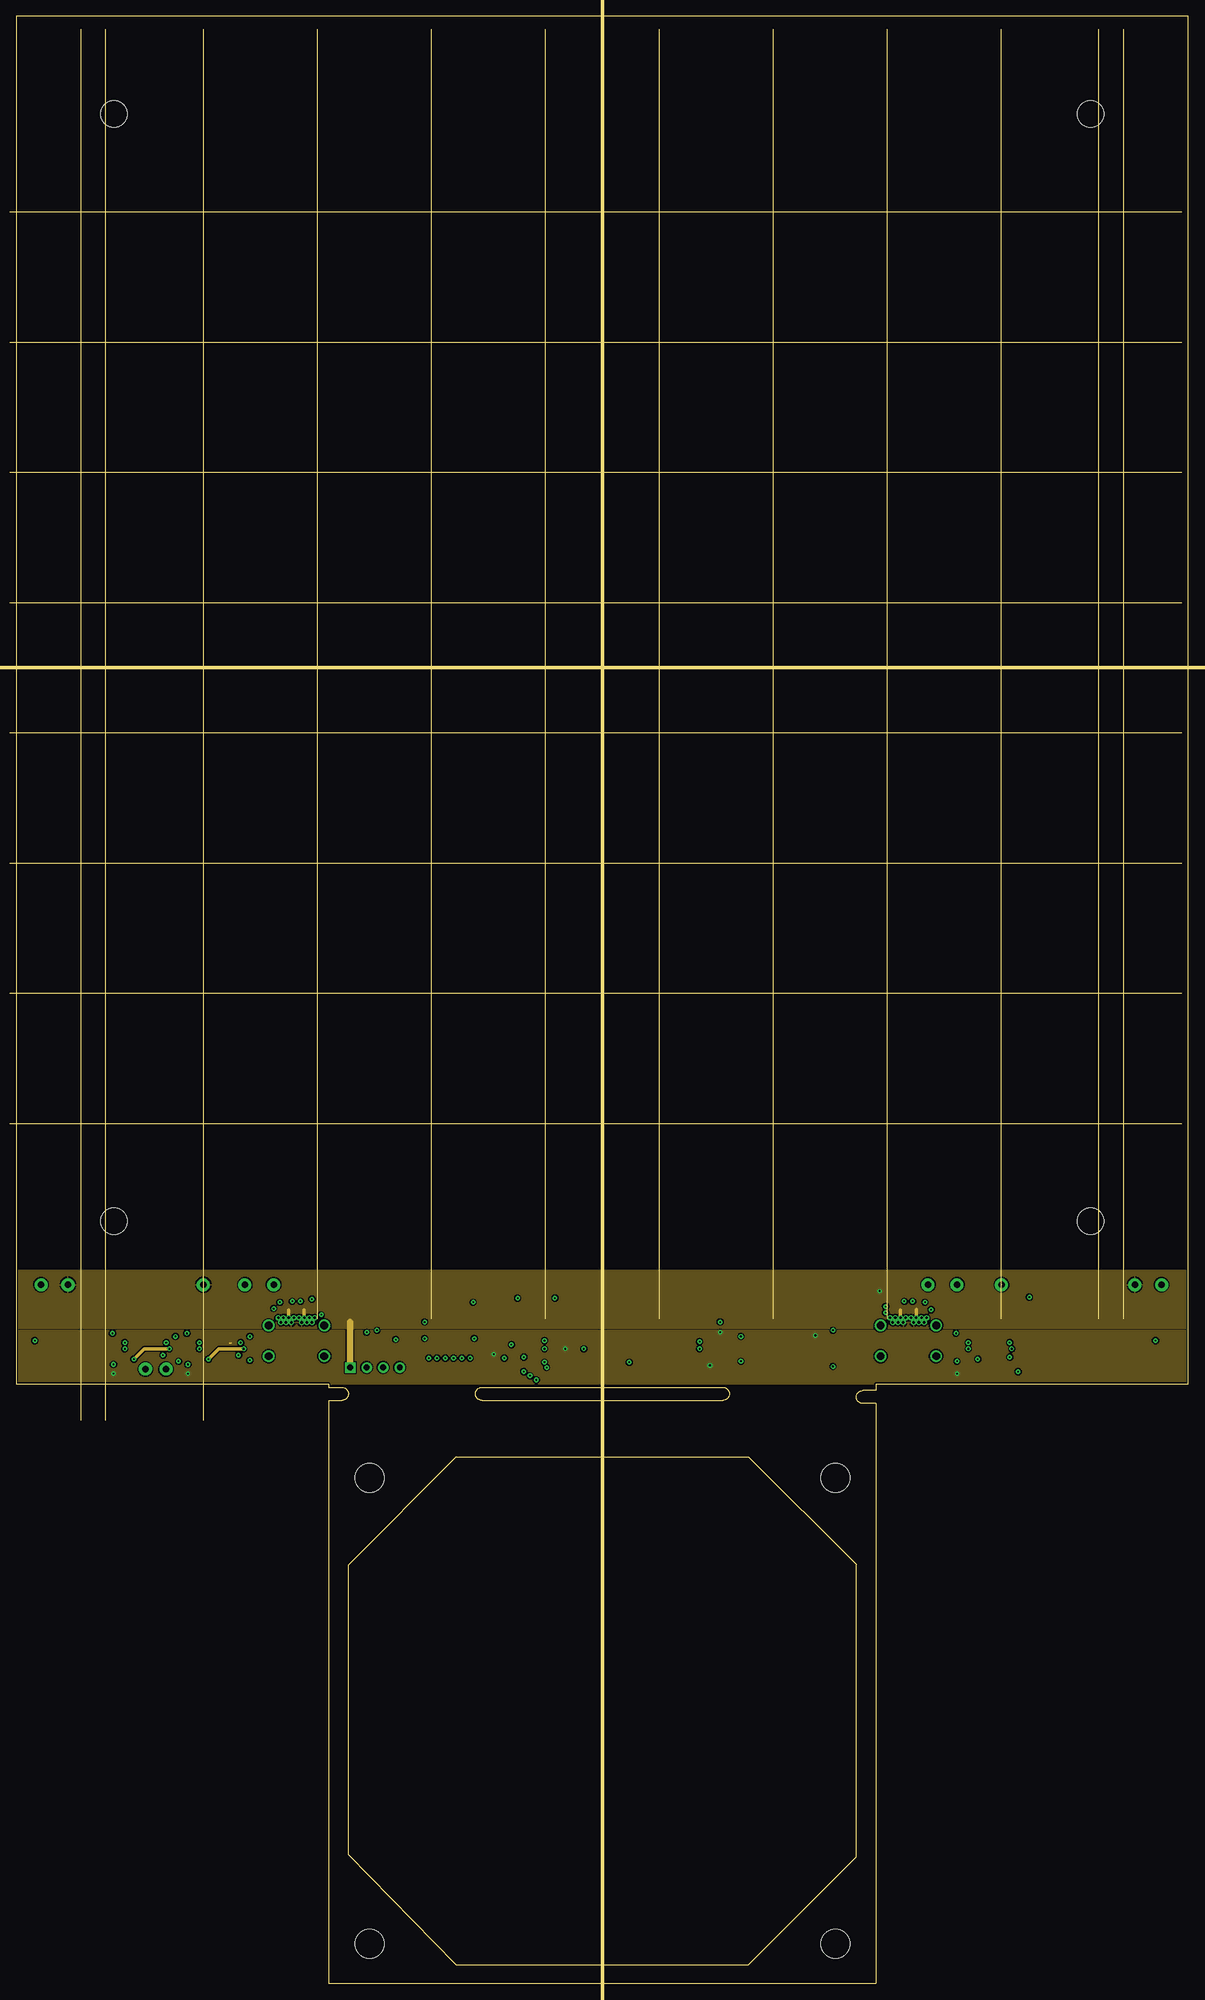
[diagram p5: board, inner layer Route2]
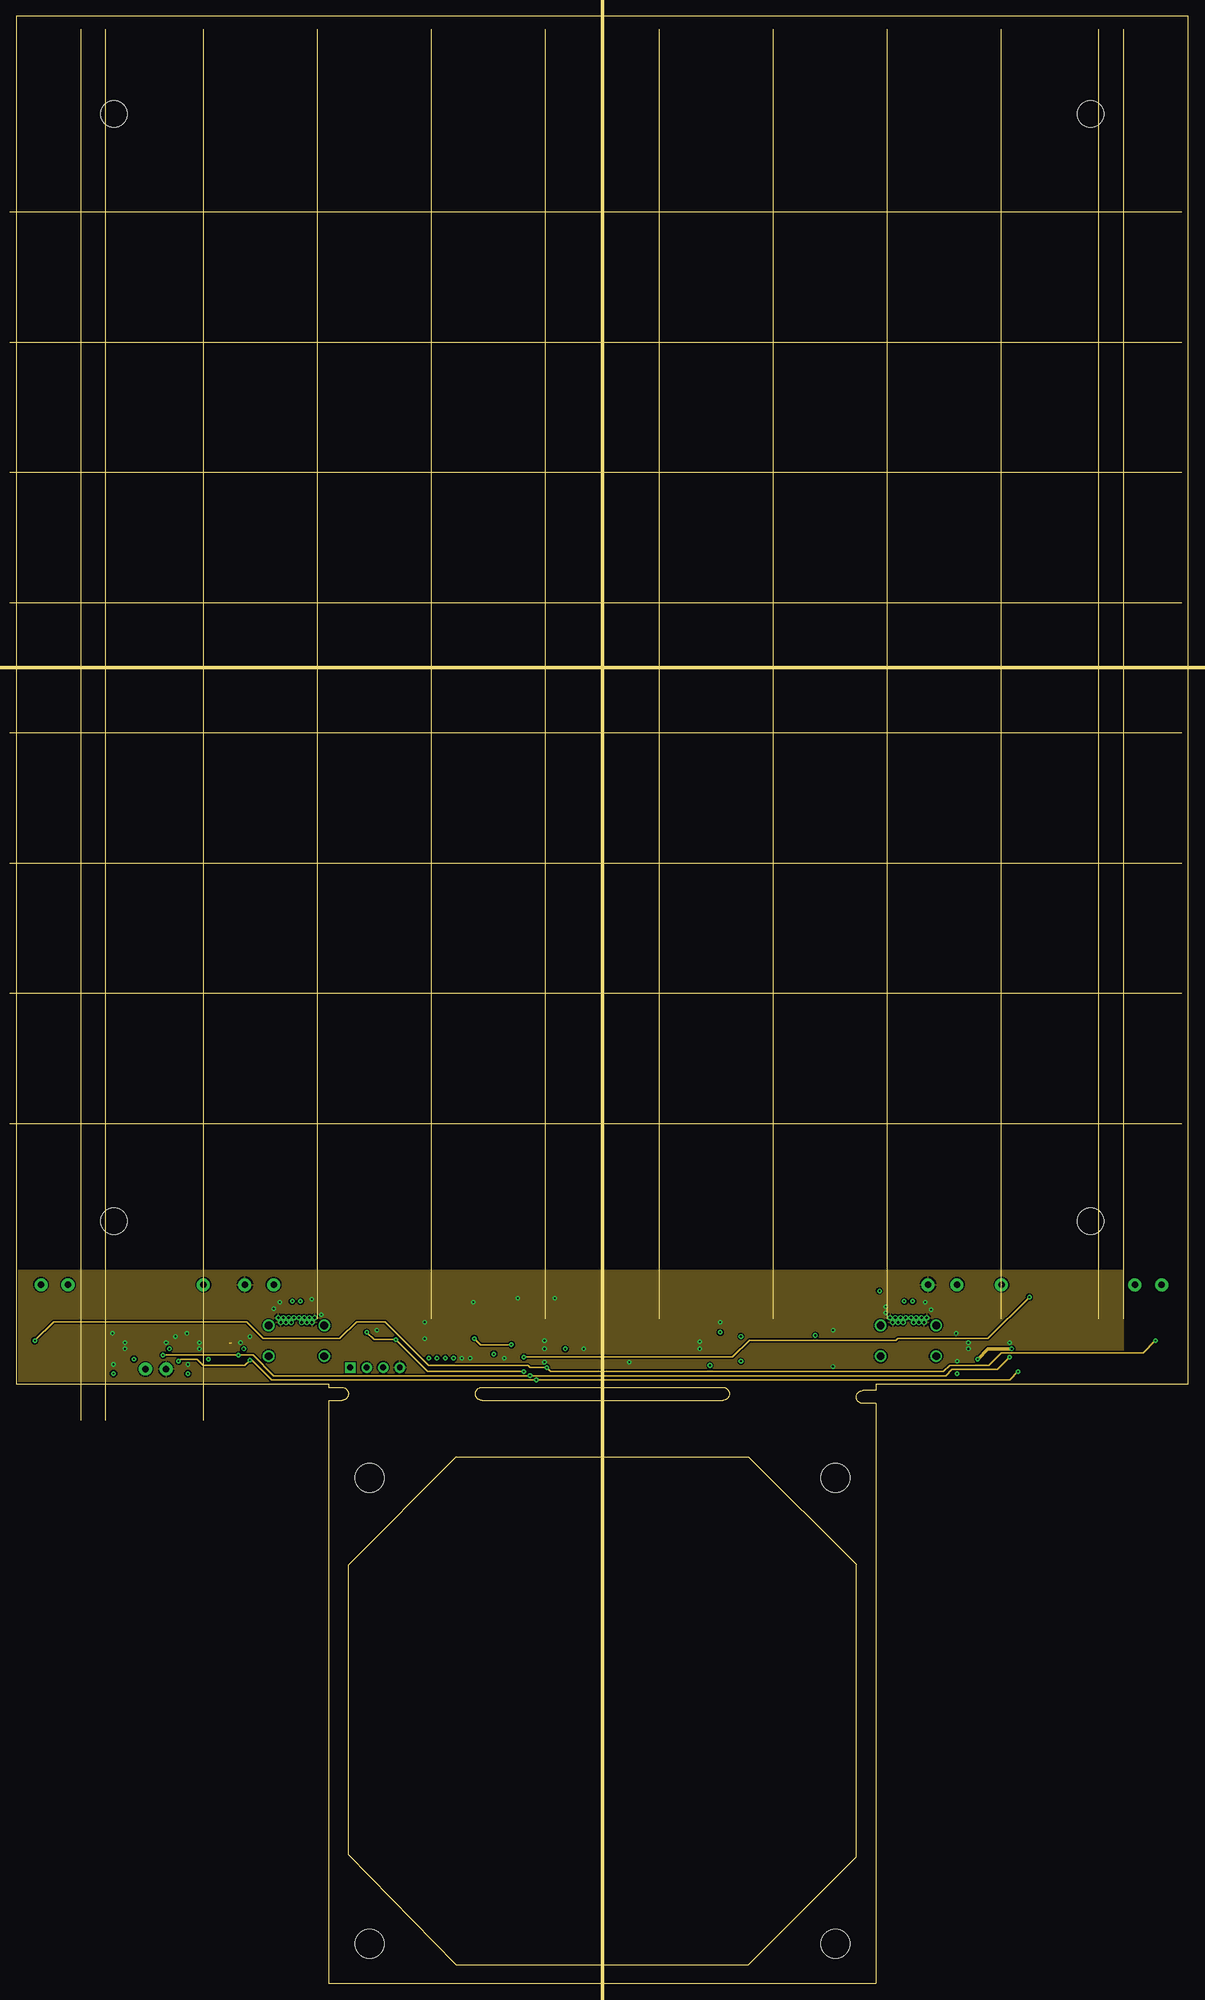
[diagram p6: board, inner layer Route15]
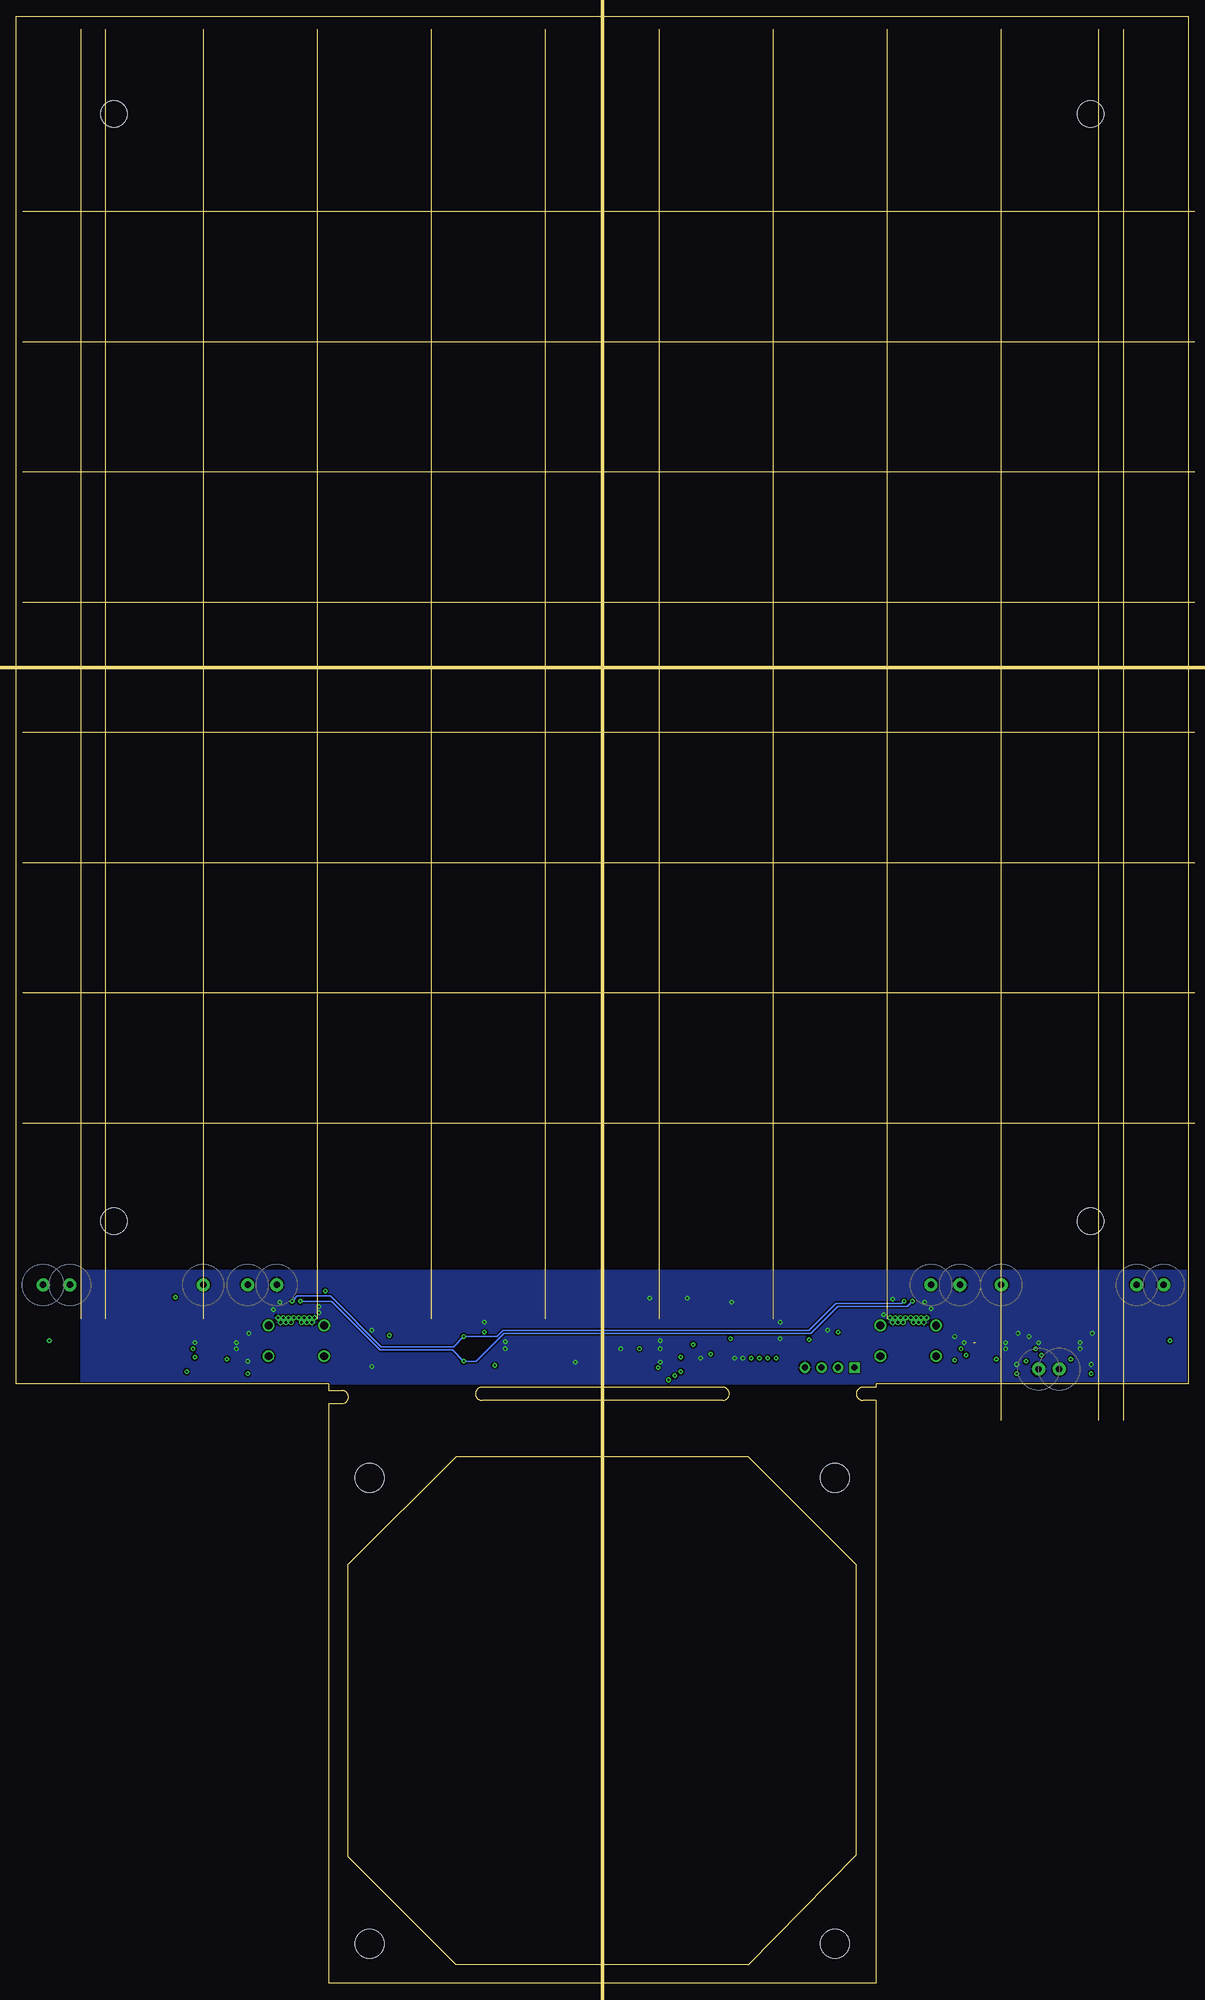
[diagram p7: board, bottom side, seen from below]

Size 180 x 302 mm. Coordinates in mm from the lower left corner, seen from the top.
Outline: 0,92 48,92 48,91.5 50,91.5 arc-180 50,89.5 48,89.5 48,0 132,0 132,89 130,89 arc-180 130,91 132,91 132,92 180,92 180,302 0,302 0,92
Copper layers (1*2+15*16): Top 0.018mm / dielectric 0.4mm / Route2 0.035mm / dielectric 0.71mm / Route15 0.035mm / dielectric 0.4mm / Bottom 0.018mm
Design rules: minimum track width 0.15mm, minimum drill 0.25mm, track to track 0.2mm, track to pad 0.2mm, pad to pad 0.2mm, via to via 0.2mm, smd to smd 0mil, copper to edge 0.25mm, drill to drill 0.15mm, minimum pad ring 0.2mm, minimum via ring 0.2mm, stop-mask expansion 0mil, vias tented up to drill 0.4mm, thermal gap 10mil
Milling: 26 lines

### Footprints (pad centres in the part's own frame; a part is rotated, then mirrored left to right if it is on the bottom)
CAP0603 = smd 0.95 x 1: 1 -0.821,0.002; 2 0.822,0
DIODE_SMA = smd 2.1 x 1.8: A -2.2,0; C 2.2,0
DIODE_SOD323 = smd 1 x 0.6: 1- -1.1,0; 2 1.1,0
HOLE_NPTH_4.1MM = hole 4.1: 0,0
HOLE_PTH_1.0MM = drill 1 pad 2: 1 0,0
FAN_80X80MM_SANYO_SANACE80 = hole 4.5: -35.75,-35.75; 35.75,-35.75; -35.75,35.75; 35.75,35.75
PAD_ROUND_3.2MM = smd 3.2 x 3.2: P 0,0
CON_USB-C_RECEPTABLE_THT-SMD = smd 0.3 x 1.2: A1 -2.75,1.25; A2 -2.25,1.25; A3 -1.75,1.25; A4 -1.25,1.25; A5 -0.75,1.25; A6 -0.25,1.25; A7 0.25,1.25; A8 0.75,1.25; A9 1.25,1.25; A10 1.75,1.25; A11 2.25,1.25; A12 2.75,1.25 | drill 0.4 pad 0.65: B1 2.8,0; B2 2.4,-0.7; B3 1.6,-0.7; B4 1.2,0; B5 0.8,-0.7; B6 0.4,0; B7 -0.4,0; B8 -0.8,-0.7; B9 -1.2,0; B10 -1.6,-0.7; B11 -2.4,-0.7; B12 -2.8,0; BG1 2,0; BG2 -2,0 | drill 1.2 pad 1.8: C1 -4.27,-5.88; C2 4.27,-5.88; C3 -4.27,-1.15; C4 4.27,-1.15
CON_DF58-3P-1.2V_SMD = smd 0.65 x 0.6: 1 -1.15,4.4; 2 0.05,4.4; 3 1.25,4.4 | smd 0.85 x 1.4: GND1 -2.8,0.7; GND2 2.8,0.7
CON_MOLEX_3H+SMD = smd 2 x 3: 1 -2.54,0; 2 0,0; 3 2.54,0
GOLD4X1 = drill 0.9 pad 1.6 square: 1 -3.81,0 | drill 0.9 pad 1.6: 2 -1.27,0; 3 1.27,0; 4 3.81,0
L_0603 = smd 0.95 x 1: 1 -0.821,0.002; 2 0.822,0
LED_SMD_0603 = smd 0.95 x 1: A -0.827,0; C 0.827,0
LED_SMD_PLCC2 = smd 1.5 x 2.6: A -1.55,0; C 1.55,0
RES0805 = smd 1 x 1.5: 1 -1.1,0; 2 1.1,0
RES0603 = smd 0.95 x 1: 1 -0.821,0.002; 2 0.822,0
RES2512 = smd 1.8 x 3.2: 1 -2.8,0; 2 2.8,0
SWITCH_SMD_PBUTTON_2P = smd 1.5 x 1.4: 1 -3.75,0; 2 3.75,0
NFET_SOT23 = smd 1 x 1.4: 1 -0.95,-1.1; 2 0.95,-1.1; 3 0,1.1
SOT23-5 = smd 0.62 x 1.22: 1 -0.95,-1.4; 2 0,-1.4; 3 0.95,-1.4; 4 0.95,1.4; 5 -0.95,1.4
TSSOP20 = smd 0.305 x 0.991: 1 -2.925,-2.918; 2 -2.275,-2.918; 3 -1.625,-2.918; 4 -0.975,-2.918; 5 -0.325,-2.918; 6 0.325,-2.918; 7 0.975,-2.918; 8 1.625,-2.918; 9 2.275,-2.918; 10 2.925,-2.918; 11 2.925,2.918; 12 2.275,2.918; 13 1.625,2.918; 14 0.975,2.918; 15 0.325,2.918; 16 -0.325,2.918; 17 -0.975,2.918; 18 -1.625,2.918; 19 -2.275,2.918; 20 -2.925,2.918
SOT23-8 = smd 0.4 x 1.22: 1 -0.975,-1.4; 2 -0.325,-1.4; 3 0.325,-1.4; 4 0.975,-1.4; 5 0.975,1.4; 6 0.325,1.4; 7 -0.325,1.4; 8 -0.975,1.4
SOT23-6 = smd 0.62 x 1.22: 1 -0.95,-1.4; 2 0,-1.4; 3 0.95,-1.4; 4 0.95,1.4; 5 0,1.4; 6 -0.95,1.4
ZENER_SOD80 = smd 1.4 x 1.8: 1 -1.7,0; 2 1.7,0

### Placement (x,y rotation side)
C01  123.67,94.14 0 top
C02  123.67,100.25 0 top
C10D  74.14,95.97 0 top
C10R  70.26,102.63 90 top
C11D  85.25,97.39 0 top
C12D  107.16,100.73 90 top
C30F  146.21,99.78 0 top
C30R  146.21,95.01 0 top
C31F  28.1,99.78 0 top
C31R  28.1,95.01 0 top
C32F  16.67,99.78 0 top
C32R  16.67,95.01 0 top
D01  131.28,106.28 180 top
D20F  53.81,98.03 270 top
H1  165,287 0 top
H2  15,117 0 top
H3  165,117 0 top
H4  15,287 0 top
H5  151.29,107.24 0 top
H6  28.73,107.24 0 top
H7  144.46,107.24 0 top
H8  140.02,107.24 0 top
H9  90.01,41.83 0 top
H10  7.94,107.24 0 top
H11  39.53,107.24 0 top
H12  35.08,107.24 0 top
H13  19.83,94.3 0 top
H14  23.01,94.3 0 top
H15  171.77,107.24 180 top
H16  175.89,107.24 0 top
H17  3.81,107.24 0 top
H18  7.94,107.24 90 top
H19  151.29,107.24 90 top
H20  171.77,107.24 90 top
H21  28.73,107.24 90 top
H22  3.81,107.24 90 top
H23  175.89,107.24 90 top
H24  144.46,107.24 90 top
H25  140.02,107.24 90 top
H26  39.53,107.24 90 top
H27  35.08,107.24 90 top
J10B  137,102.16 0 top
J10P  79.85,105.65 180 top
J10S  66.52,95.49 0 top
J11B  43.02,102.16 0 top
J20F  55.09,94.54 0 top
L10  74.14,97.39 0 top
L30R  146.21,93.59 0 top
L31R  28.1,93.59 0 top
L32R  16.67,93.59 0 top
LD01-G  126.51,95.26 270 top
LD02-G  120.8,95.26 270 top
LD10-R  92.23,93.9 0 top
LD11-G  92.23,95.81 0 top
LD12R  103.66,94.06 90 top
LD13G  103.66,100.73 270 top
LD20-R  158.91,107.24 270 top
LD20A  13.75,132 90 top
LD20B  166.25,132 90 top
LD21A  13.75,152 90 top
LD21B  166.25,152 90 top
LD22A  13.75,172 90 top
LD22B  166.25,172 90 top
LD23A  13.75,192 90 top
LD23B  166.25,192 90 top
LD24A  13.75,212 90 top
LD24B  166.25,212 90 top
LD25A  13.75,232 90 top
LD25B  166.25,232 90 top
LD26A  13.75,252 90 top
LD26B  166.25,252 90 top
LD27A  13.75,272 90 top
LD27B  166.25,272 90 top
PT30  142.49,201.95 180 top
PT31  37.3,201.85 180 top
R01L  126.51,98.12 270 top
R02L  120.8,98.12 270 top
R10B  74.14,100.25 0 top
R10L  89.38,93.9 0 top
R10T  108.11,97.39 90 top
R11B  74.14,98.98 0 top
R11L  89.38,95.81 0 top
R12L  105.57,94.06 270 top
R13L  105.56,100.73 90 top
R20A  28.75,132 90 top
R20AL  3.81,104.38 270 top
R20B  46.25,132 90 top
R20BL  175.89,104.38 270 top
R20C  63.75,132 90 top
R20D  81.25,132 90 top
R20E  98.75,132 90 top
R20F  116.25,132 90 top
R20G  133.75,132 90 top
R20H  151.25,132 90 top
R20L  157.32,107.24 90 top
R21A  28.75,152 90 top
R21B  46.25,152 90 top
R21C  63.75,152 90 top
R21D  81.25,152 90 top
R21E  98.75,152 90 top
R21F  116.25,152 90 top
R21G  133.75,152 90 top
R21H  151.25,152 90 top
R22A  28.75,172 90 top
R22B  46.25,172 90 top
R22C  63.75,172 90 top
R22D  81.25,172.05 90 top
R22E  98.75,172 90 top
R22F  116.25,172 90 top
R22G  133.75,172 90 top
R22H  151.25,172 90 top
R23A  28.75,192 90 top
R23B  46.25,192 90 top
R23C  63.75,192 90 top
R23D  81.25,192 90 top
R23E  98.75,192 90 top
R23F  116.25,192 90 top
R23G  133.75,192 90 top
R23H  151.25,192 90 top
R24A  28.75,212 90 top
R24B  46.25,212 90 top
R24C  63.75,212 90 top
R24D  81.25,212 90 top
R24E  98.75,212 90 top
R24F  116.25,212 90 top
R24G  133.75,212 90 top
R24H  151.25,212 90 top
R25A  28.75,232 90 top
R25B  46.25,232 90 top
R25C  63.75,232 90 top
R25D  81.25,232 90 top
R25E  98.75,232 90 top
R25F  116.25,232 90 top
R25G  133.75,232 90 top
R25H  151.25,232 90 top
R26A  28.75,252 90 top
R26B  46.25,252 90 top
R26C  63.75,252 90 top
R26D  81.25,252 90 top
R26E  98.75,252 90 top
R26F  116.25,252 90 top
R26G  133.75,252 90 top
R26H  151.25,252 90 top
R27A  28.75,272 90 top
R27B  46.25,272 90 top
R27C  63.75,272 90 top
R27D  81.25,272 90 top
R27E  98.75,272 90 top
R27F  116.25,272 90 top
R27G  133.75,272 90 top
R27H  151.25,272 90 top
R30C  149.38,97.39 270 top
R31C  31.27,97.39 270 top
R32C  19.84,97.39 270 top
RESET  66.52,100.25 0 top
T20A  3.81,100.89 0 top
T20B  175.89,100.89 0 top
T20F  56.35,97.71 180 top
T20H  154.46,107.24 90 top
U01  123.67,97.08 0 top
U10  79.85,97.08 270 top
U11  104.93,97.39 270 top
U30N  152.56,97.39 270 top
U30R  146.21,97.39 270 top
U31N  34.45,97.39 270 top
U31R  28.1,97.39 270 top
U32N  23.02,97.39 270 top
U32R  16.67,97.39 270 top
Z01  124.94,106.28 0 top
Z02  124.94,102.47 180 top
Z10U  111.82,99.36 180 top
Z11U  111.9,95.55 180 top

### Tracks (layer width: path | path; a pad name or v marks a point on that pad's centre or on a via)
!RST  (via drill 0.25 pad 0.7)
  Top 0.203: U10.4 76.06,98.05 v76.04,98.03
  Top 0.762: C10R.1 RESET.2
  Top 1.016: RESET.2 70.27,99.04 v70.33,98.98
  Route15 0.254: v70.33,98.98 71.28,98.03 v76.04,98.03
BUS_A  (via drill 0.25 pad 0.7)
  Top 0.254: J11B.A6 42.77,104.31 v42.38,104.7
  Top 0.305: U11.6 107.61,97.07 R10T.1 | v136.37,104.7 136.75,104.31 J10B.A6
  Top 0.762: R10T.1 109.17,96.57 Z11U.2
  Top 1.016: Z11U.2 110.26,95.49 v111.28,95.49
  Bottom 0.254: v42.38,104.7 43.18,103.9 53.81,103.9 57.94,99.78 105.09,99.78 109.38,95.49 v111.28,95.49 113.03,97.24 124.14,97.24 131.6,104.7 v136.37,104.7
BUS_B  (via drill 0.25 pad 0.7)
  Top 0.254: J11B.A7 43.27,104.31 v43.66,104.7
  Top 0.305: U11.7 107.61,97.72 R10T.2 | v137.63,104.7 137.25,104.31 J10B.A7
  Top 0.762: R10T.2 108.97,98.22 Z10U.2
  Top 1.016: Z10U.2 110.18,99.3 v111.28,99.3
  Bottom 0.254: v43.66,104.7 43.97,104.38 54.13,104.38 58.26,100.25 105.25,100.25 106.2,99.3 v111.28,99.3 112.87,97.71 123.98,97.71 131.76,105.49 136.84,105.49 v137.63,104.7
DIR_485
  Top 0.203: U11.2 U11.3 104.3,97.08 104.61,96.76 104.61,94.22 104.46,94.06 102.23,94.06 100.81,92.63 83.66,92.63 82.77,93.53 U10.11
FAN  (via drill 0.25 pad 0.7)
  Top 0.254: U10.10 77.69,94.15 v77.94,93.9
  Top 0.508: T20F.1 57.32,98.82 | v53.81,99.94 D20F.1-
  Top 0.762: 57.32,98.82 v58.26,98.82
  Route15 0.254: v53.81,99.94 54.93,98.82 v58.26,98.82 63.18,93.9 v77.94,93.9
GND  (via drill 0.25 pad 0.7)
  Top 0.305: J10B.A1 134.25,102.27 134.14,102.16 | J10B.A12 139.75,102.27 139.86,102.16 | J11B.A1 40.27,102.27 40.16,102.16 | J11B.A12 45.77,102.27 45.88,102.16
  Top 0.762: PT31.2 36.2,201.59 36.7,201.1 36.7,108.86 H27.P | PT30.2 141.39,201.71 141.9,201.2 141.9,109.12 H25.P
  other vias: 76.99,105.17 82.71,105.17 26.19,99.78 14.76,99.78 55.4,100.25 28.1,98.35 23.02,98.35 144.46,95.49 34.45,98.35 144.3,99.78 62.7,98.98 62.7,101.52 146.21,97.39 152.56,98.35 81.12,98.66 24.45,99.3 68.42,95.97 69.69,95.97 146.21,98.35 104.93,97.39 35.88,99.3 28.1,97.39 16.67,98.35 74.93,95.97 108.11,101.52 87.15,97.39 16.67,97.39 94.14,95.33 14.92,95.01 81.12,97.39 81.12,95.33 104.93,98.51 26.35,95.01 133.51,102.95 140.49,103.43 133.51,103.9 139.54,104.54 39.53,103.59 45.4,105.02 46.83,102.63 40.48,104.54 70.17,104.54 125.41,100.25 125.41,94.7
  pour Top (rank 2): -0.16,92 -0.16,109.47 180.19,109.47 180.19,92
  pour Route15: -0.16,92 -0.16,109.46 170.02,109.46 170.02,92
  pour Bottom: -0.16,92 -0.16,109.46 170.02,109.46 170.02,92
HEATER  (via drill 0.25 pad 0.7)
  Top 0.254: U10.7 77.92,96.1 v77.94,96.12
  Top 0.762: R20L.1 157.19,106.29 T20H.1 155.56,105.34 v155.57,105.33
  Route15 0.254: v77.94,96.12 110.01,96.12 112.55,98.66 135.09,98.66 135.41,98.98 149.22,98.98 v155.57,105.33
LED_GRN
  Top 0.203: R11L.1
  Top 0.254: 88.2,95.45 R11L.1 88.26,96.1 U10.14
LED_RED
  Top 0.203: R10L.1
  Top 0.254: U10.13 87.01,95.45 R10L.1
LEDS  (via drill 0.25 pad 0.7)
  Top 0.254: U10.12 81.7,94.8 v81.44,94.54
  Top 0.762: T20B.1 v174.94,98.67 v174.94,98.66 | T20A.1 v2.86,98.67 v2.86,98.66
  Route15 0.254: v174.94,98.66 173.04,96.76 151.29,96.76 149.38,94.86 143.35,94.86 142.4,93.9 82.07,93.9 v81.44,94.54 78.9,94.54 78.58,94.86 63.34,94.86 56.67,101.52 52.23,101.52 49.69,98.98 37.94,98.98 35.4,101.52 5.71,101.52 v2.86,98.66
N$1  (via drill 0.25 pad 0.7)
  Top 0.305: U31R.3 U31R.4
  Top 0.508: U31R.4 v29.5,95.81 29.5,95.59 C31R.2 | U31N.5 v34.92,97.39
  Top 0.762: L31R.2 C31R.2
  Route2 0.508: v34.92,97.39 31.09,97.39 v29.5,95.81
N$2  (via drill 0.25 pad 0.7)
  Top 0.305: U32R.3 U32R.4
  Top 0.508: U32R.4 v18.07,95.81 | v18.07,95.81 18.07,95.59 C32R.2 | U32N.5 v23.49,97.39 | v18.07,95.81 18.07,95.68
  Top 0.762: L32R.2 C32R.2
  Route2 0.508: v23.49,97.39 19.66,97.39 v18.07,95.81
N$3
  Top 0.762: LD02-G.A R02L.2
N$4
  pour Top: 17,132.5 37,132.5 37,151.5 17,151.5
N$5
  pour Top: 17,152.5 37,152.5 37,171.5 17,171.5
N$6
  pour Top: 17,172.5 37,172.5 37,191.5 17,191.5
N$7
  pour Top: 17,192.5 37,192.5 37,211.5 17,211.5
N$8
  pour Top: 17,212.5 37,212.5 37,231.5 17,231.5
N$9
  pour Top: 17,232.5 37,232.5 37,251.5 17,251.5
N$10
  pour Top: 17,252.5 37,252.5 37,271.5 17,271.5
N$11
  pour Top: 37.5,132.5 54.5,132.5 54.5,151.5 37.5,151.5
N$12
  pour Top: 37.5,152.5 54.5,152.5 54.5,171.5 37.5,171.5
N$13  (via drill 0.25 pad 0.7)
  Top 0.305: U30R.3 U30R.4
  Top 0.508: U30N.5 v152.88,97.39 | U30R.4 147.61,95.84 v147.64,95.81 147.64,95.46 147.03,94.86
  Top 0.762: L30R.2 147.03,94.86 C30R.2
  Route15 0.508: v152.88,97.39 149.22,97.39 v147.64,95.81
N$14
  pour Top: 37.5,172.5 54.5,172.5 54.5,191.5 37.5,191.5
N$15
  pour Top: 37.5,192.5 54.5,192.5 54.5,211.5 37.5,211.5
N$16
  pour Top: 37.5,212.5 54.5,212.5 54.5,231.5 37.5,231.5
N$17
  pour Top: 37.5,232.5 54.5,232.5 54.5,251.5 37.5,251.5
N$18
  pour Top: 37.5,252.5 54.5,252.5 54.5,271.5 37.5,271.5
N$19
  pour Top: 16.92,272.5 54.5,272.5 54.5,299.5 22,299.5
N$20
  pour Top: 55,132.5 72,132.5 72,151.5 55,151.5
N$21
  pour Top: 55,152.5 72,152.5 72,171.5 55,171.5
N$22
  pour Top: 55,172.5 72,172.5 72,191.5 55,191.5
N$23
  pour Top: 55,192.5 72,192.5 72,211.5 55,211.5
N$24
  pour Top: 55,212.5 72,212.5 72,231.5 55,231.5
N$25
  Top 0.762: LD01-G.A R01L.2
N$26
  pour Top: 55,232.5 72,232.5 72,251.5 55,251.5
N$27
  pour Top: 55,252.5 72,252.5 72,271.5 55,271.5
N$28
  pour Top: 37.5,112.5 72,112.5 72,131.5 37.5,131.5
N$29
  pour Top: 72.5,132.5 89.5,132.5 89.5,151.5 72.5,151.5
N$30
  pour Top: 72.5,152.5 89.5,152.5 89.5,171.5 72.5,171.5
N$31
  pour Top: 72.5,172.5 89.5,172.5 89.5,191.5 72.5,191.5
N$32
  pour Top: 72.5,192.5 89.5,192.5 89.5,211.5 72.5,211.5
N$33
  pour Top: 72.5,212.5 89.5,212.5 89.5,231.5 72.5,231.5
N$34
  pour Top: 72.5,232.5 89.5,232.5 89.5,251.5 72.5,251.5
N$35
  pour Top: 72.5,252.5 89.5,252.5 89.5,271.5 72.5,271.5
N$36
  pour Top: 55,272.5 89.5,272.5 89.5,299.5 55,299.5
N$37
  pour Top: 90,132.5 107,132.5 107,151.5 90,151.5
N$38
  pour Top: 90,152.5 107,152.5 107,171.5 90,171.5
N$39
  pour Top: 90,172.5 107,172.5 107,191.5 90,191.5
N$40
  pour Top: 90,192.5 107,192.5 107,211.5 90,211.5
N$41
  pour Top: 90,212.5 107,212.5 107,231.5 90,231.5
N$42
  pour Top: 90,232.5 107,232.5 107,251.5 90,251.5
N$43
  pour Top: 90,252.5 107,252.5 107,271.5 90,271.5
N$44
  pour Top: 72.5,112.5 107,112.5 107,131.5 72.5,131.5
N$45
  pour Top: 107.5,132.5 124.5,132.5 124.5,151.5 107.5,151.5
N$46
  pour Top: 107.5,152.5 124.5,152.5 124.5,171.5 107.5,171.5
N$47
  pour Top: 107.5,172.5 124.5,172.5 124.5,191.5 107.5,191.5
N$48
  pour Top: 107.5,192.5 124.5,192.5 124.5,211.5 107.5,211.5
N$49
  pour Top: 107.5,212.5 124.5,212.5 124.5,231.5 107.5,231.5
N$50
  pour Top: 107.5,232.5 124.5,232.5 124.5,251.5 107.5,251.5
N$51
  pour Top: 107.5,252.5 124.5,252.5 124.5,271.5 107.5,271.5
N$52
  pour Top: 90,272.5 124.5,272.5 124.5,299.5 90,299.5
N$53
  pour Top: 125,132.5 142,132.5 142,151.5 125,151.5
N$54
  pour Top: 125,152.5 142,152.5 142,171.5 125,171.5
N$55
  pour Top: 125,172.5 142,172.5 142,191.5 125,191.5
N$56
  pour Top: 125,192.5 142,192.5 142,211.5 125,211.5
N$57
  pour Top: 125,212.5 142,212.5 142,231.5 125,231.5
N$58
  pour Top: 125,232.5 142,232.5 142,251.5 125,251.5
N$59
  pour Top: 125,252.5 142,252.5 142,271.5 125,271.5
N$60
  pour Top: 107.5,112.5 142,112.5 142,131.5 107.5,131.5
N$61
  pour Top: 142.5,132.5 162.5,132.5 162.5,151.5 142.5,151.5
N$62
  pour Top: 142.5,152.5 162.5,152.5 162.5,171.5 142.5,171.5
N$63
  pour Top: 142.5,172.5 162.5,172.5 162.5,191.5 142.5,191.5
N$64
  pour Top: 142.5,192.5 162.5,192.5 162.5,211.5 142.5,211.5
N$65
  pour Top: 142.5,212.5 162.5,212.5 162.5,231.5 142.5,231.5
N$66
  pour Top: 142.5,232.5 162.5,232.5 162.5,251.5 142.5,251.5
N$67
  pour Top: 142.5,252.5 162.5,252.5 162.5,271.5 142.5,271.5
N$68
  pour Top: 125,272.5 162.44,272.5 158,299.5 125,299.5
N$69  (1 unrouted)
  Top 1.016: T20H.3 H19.P
  Top 2.032: R20H.1 151.25,107.28
  pour Top: 142.5,112.5 158,112.5 162.44,131.5 142.5,131.5
N$70
  Top 0.762: R20L.2 LD20-R.A
N$71
  Top 1.27: LD20A.C LD21A.A
N$72
  Top 1.27: LD21A.C LD22A.A
N$73
  Top 1.27: LD22A.C LD23A.A
N$74
  Top 1.27: LD24A.A LD23A.C
N$75
  Top 1.27: LD24A.C LD25A.A
N$76
  Top 1.27: LD25A.C LD26A.A
N$77
  Top 1.27: LD20B.C LD21B.A
N$78
  Top 1.27: LD21B.C LD22B.A
N$79
  Top 1.27: LD22B.C LD23B.A
N$80
  Top 1.27: LD23B.C LD24B.A
N$81
  Top 1.27: LD24B.C LD25B.A
N$82
  Top 1.27: LD25B.C LD26B.A
N$83
  Top 1.27: LD26A.C LD27A.A
N$84
  Top 1.27: LD26B.C LD27B.A
N$85
  Top 0.762: H23.P R20BL.1
  Top 1.27: H23.P 175.89,268.05 170.4,273.55 LD27B.C
N$86
  Top 0.762: H22.P R20AL.1
  Top 1.27: H22.P 3.81,267.73 9.62,273.55 LD27A.C
N$87
  Top 0.762: T20A.3 R20AL.2
N$88
  Top 0.762: T20B.3 R20BL.2
N$89
  Top 0.762: T20F.3 J20F.3
N$90
  Top 0.508: D20F.2 J20F.2
N$148
  Top 0.762: LD11-G.A R11L.2
N$149
  Top 0.762: LD10-R.A R10L.2
N$151
  Top 1.27: D01.C Z01.2
N$152
  Top 0.762: LD13G.A R13L.2
N$153
  Top 0.762: LD12R.A R12L.2
N$162
  Top 1.016: Z02.2 Z01.1
RTD30  (1 unrouted)
  Top 0.254: R30C.2 149.38,96.6 150.18,97.39 150.18,98.19 150.34,98.35 U30N.1
  Top 0.508: U30N.1 151.16,101.02 148.75,103.43 145.89,103.43 144.46,104.86 H24.P
  Top 0.762: 143.59,201.93 143.59,201.69 143.1,201.2 143.1,108.6 H24.P
RTD31  (1 unrouted)
  Top 0.254: R31C.2 32.07,97.37 32.07,98.19 32.22,98.34 32.7,98.34
  Top 0.508: U31N.1 33.05,100.76 H26.P
  Top 0.762: PT31.1 38.41,201.61 37.9,201.1 37.9,108.86 H26.P
RTD32
  Top 0.254: U32N.1 20.8,98.35 20.64,98.19 20.64,97.37 R32C.2
  Top 0.305: 19.97,96.57 19.84,96.44
  Top 0.508: 19.97,96.57 R32C.2
  Top 0.762: 19.84,96.44 19.83,96.43 H13.1
RXD_232  (via drill 0.25 pad 0.7)
  Top 0.203: U10.9 76.31,94.8 74.61,93.11 64.77,93.11 63.98,93.9 J10S.1
  Top 0.254: v64.61,95.97 v63.34,95.97 63.5,95.97 J10S.1
RXD_485
  Top 0.203: U11.1 103.51,98.35 99.22,98.35 98.74,98.82 83.66,98.82 83.54,98.7 U10.18
  Top 0.305: LD13G.C 103.66,98.5 U11.1
SCL  (via drill 0.25 pad 0.7)
  Top 0.254: R11B.2 75.24,98.7 U10.3 78.54,98.7 78.9,98.35 v78.9,93.27 | v152.56,96.12 151.48,96.12 U30N.3
  Top 0.508: U32N.3 v22.54,96.44 | v34.13,96.44 U31N.3
  Route15 0.254: v22.54,96.44 v34.13,96.44 36.35,96.44 39.53,93.27 v78.9,93.27 142.72,93.27 143.67,94.22 150.65,94.22 v152.56,96.12
SDA  (via drill 0.25 pad 0.7)
  Top 0.254: R10B.2 75.09,100.12 75.09,99.94 75.56,99.94 76.15,99.35 U10.2 78.84,99.35 79.85,98.35 v79.85,92.63 | U30N.4 153.96,94.03 v153.83,93.9
  Top 0.508: U32N.4 24.6,96.44 24.92,96.12 v24.92,95.49 | U31N.4 35.88,96.44 v35.88,95.65
  Route15 0.254: v24.92,95.49 25.24,95.81 27.78,95.81 28.73,94.86 35.08,94.86 v35.88,95.65 36.19,95.65 39.21,92.63 v79.85,92.63 152.56,92.63 v153.83,93.9
SWD_CLK
  Top 0.203: U10.20 82.77,101.78 82.39,102.16 78.9,102.16 78.58,101.84 78.58,101.27 J10P.3
SWDIO
  Top 0.203: U10.19 82.02,99.35 81,100.37 J10P.1
TXD_232  (via drill 0.25 pad 0.7)
  Top 0.203: U10.8 76.32,95.45 74.45,93.59 66.83,93.59 66.52,93.9 J10S.2
  Top 0.254: v65.88,95.97 66.04,95.97 J10S.2 66.99,95.97 v67.15,95.97
TXD_485
  Top 0.203: U10.17 83.52,98.05 83.82,98.35 97.95,98.35 99.88,96.42 U11.4
  Top 0.305: U11.4 103.66,96.42 LD12R.C
VCC
  Top 0.305: U01.1 122.72,96.76 123.03,97.08 124.3,97.08 124.61,97.39 U01.4 126.05,98.48 R01L.1
  Top 0.508: U01.1 122.72,94.28 C01.1
  Top 0.762: R01L.1 126.52,98.94 126.52,102.36 Z02.1
VCCA
  Top 0.203: U10.5
  Top 0.254: L10.2 74.97,97.4 U10.5 77.3,97.4 77.31,97.39
  Top 0.305: 74.96,97.53 75.09,97.39 L10.2
VDD_3V3  (via drill 0.25 pad 0.7)
  Top 0.254: R02L.1
  Top 0.305: U01.5 121.26,98.48 R02L.1 | C11D.1 v84.3,97.39 84.29,97.4 U10.16 | U11.8 106.33,99.13 R13L.1
  Top 0.508: U01.5 v122.71,99.46 122.71,100.12 C02.1 | L32R.1 | L31R.1 | L30R.1
  Top 0.762: R13L.1 C12D.1 107.18,99.94 v108.11,99.94 | R12L.1 106.49,94.88 v106.52,94.86 | C10D.1 73.31,96.57 v73.34,96.6 73.31,96.63 L10.1 R11B.1 R10B.1 | L32R.1 v14.92,93.59 | L31R.1 v26.35,93.59 | L30R.1 v144.46,93.59
  pour Route2: -0.16,92 -0.16,100.25 180.18,100.25 180.18,92
VDD_24V  (via drill 0.25 pad 0.7)
  Top 0.305: J10B.A9 138.25,102.32 | 138.25,102.32 138.25,102.21 J10B.B4 138.2,102.09 137.95,101.84 137.95,101.61 J10B.B5 | J10B.A4 135.75,102.32 | 135.75,102.32 135.75,102.21 J10B.B9 135.8,102.09 136.05,101.84 136.05,101.61 J10B.B8 | J11B.A9 44.27,102.47 | 44.27,102.47 44.27,102.21 J11B.B4 44.22,102.09 43.97,101.84 43.97,101.68 43.81,101.52 | J11B.A4 41.77,102.47 | 41.77,102.47 41.77,102.21 J11B.B9 41.82,102.09 42.07,101.84 42.07,101.61 J11B.B8 | J10B.A8 137.75,102.82 138.25,102.32 | J10B.A5 136.25,102.82 135.75,102.32 | J11B.A5 42.27,102.97 41.77,102.47 | J11B.A8 43.77,102.97 44.27,102.47
  Top 1.016: D01.A v132.56,106.28
  Top 1.27: LD20A.A 13.75,126.23 7.94,120.41 H18.P | H20.P 171.77,120.73 166.25,126.25 LD20B.A
  Top 2.032: H21.P 28.73,129.18 R20A.1
  Route2 0.305: J10B.B9 135.8,102.09 136.05,101.84 136.05,101.61 J10B.B8 | J10B.B4 138.2,102.09 137.95,101.84 137.95,101.68 137.79,101.52
  Route2 0.508: 138.2,103.43 J10B.B4 | J10B.B9 135.8,103.34 | J11B.B9 41.82,103.36 | J11B.B4 44.22,103.36
  Route2 1.016: J20F.1 51.27,101.52
  pour Route2: -0.16,100.57 -0.16,109.46 180.18,109.46 180.18,100.57
  pour Top: 21.5,112.5 37,112.5 37,131.5 17.05,131.5
VREF30
  Top 0.254: U30R.5 148.56,97.39 R30C.1
  Top 0.508: C30F.2 147.61,99.2 U30R.6 149.26,98.34 R30C.1
VREF31
  Top 0.254: U31R.5 30.45,97.39 R31C.1
  Top 0.508: C31F.2 29.5,99.2 U31R.6 31.14,98.34 R31C.1
VREF32
  Top 0.254: U32R.5 19.02,97.39 R32C.1
  Top 0.508: C32F.2 17.33,99.94 17.3,99.94 18.07,99.17 U32R.6 19.72,98.34 R32C.1

### Text on the board
Top: 1
tPlace: SimSun HEATER | 180830-v1.0 | SimSun PID | 180902-v1.0 | A3 | A1 | A0 | Rx | Tx | GND
tDocu: 210 MM | 170 MM | 150 MM | 180 MM